# EAGLE schematic PDNode_Devboard_v0.0.1 (EAGLE 9.2.1), part 1 of 2

## Sheet 1 of 7
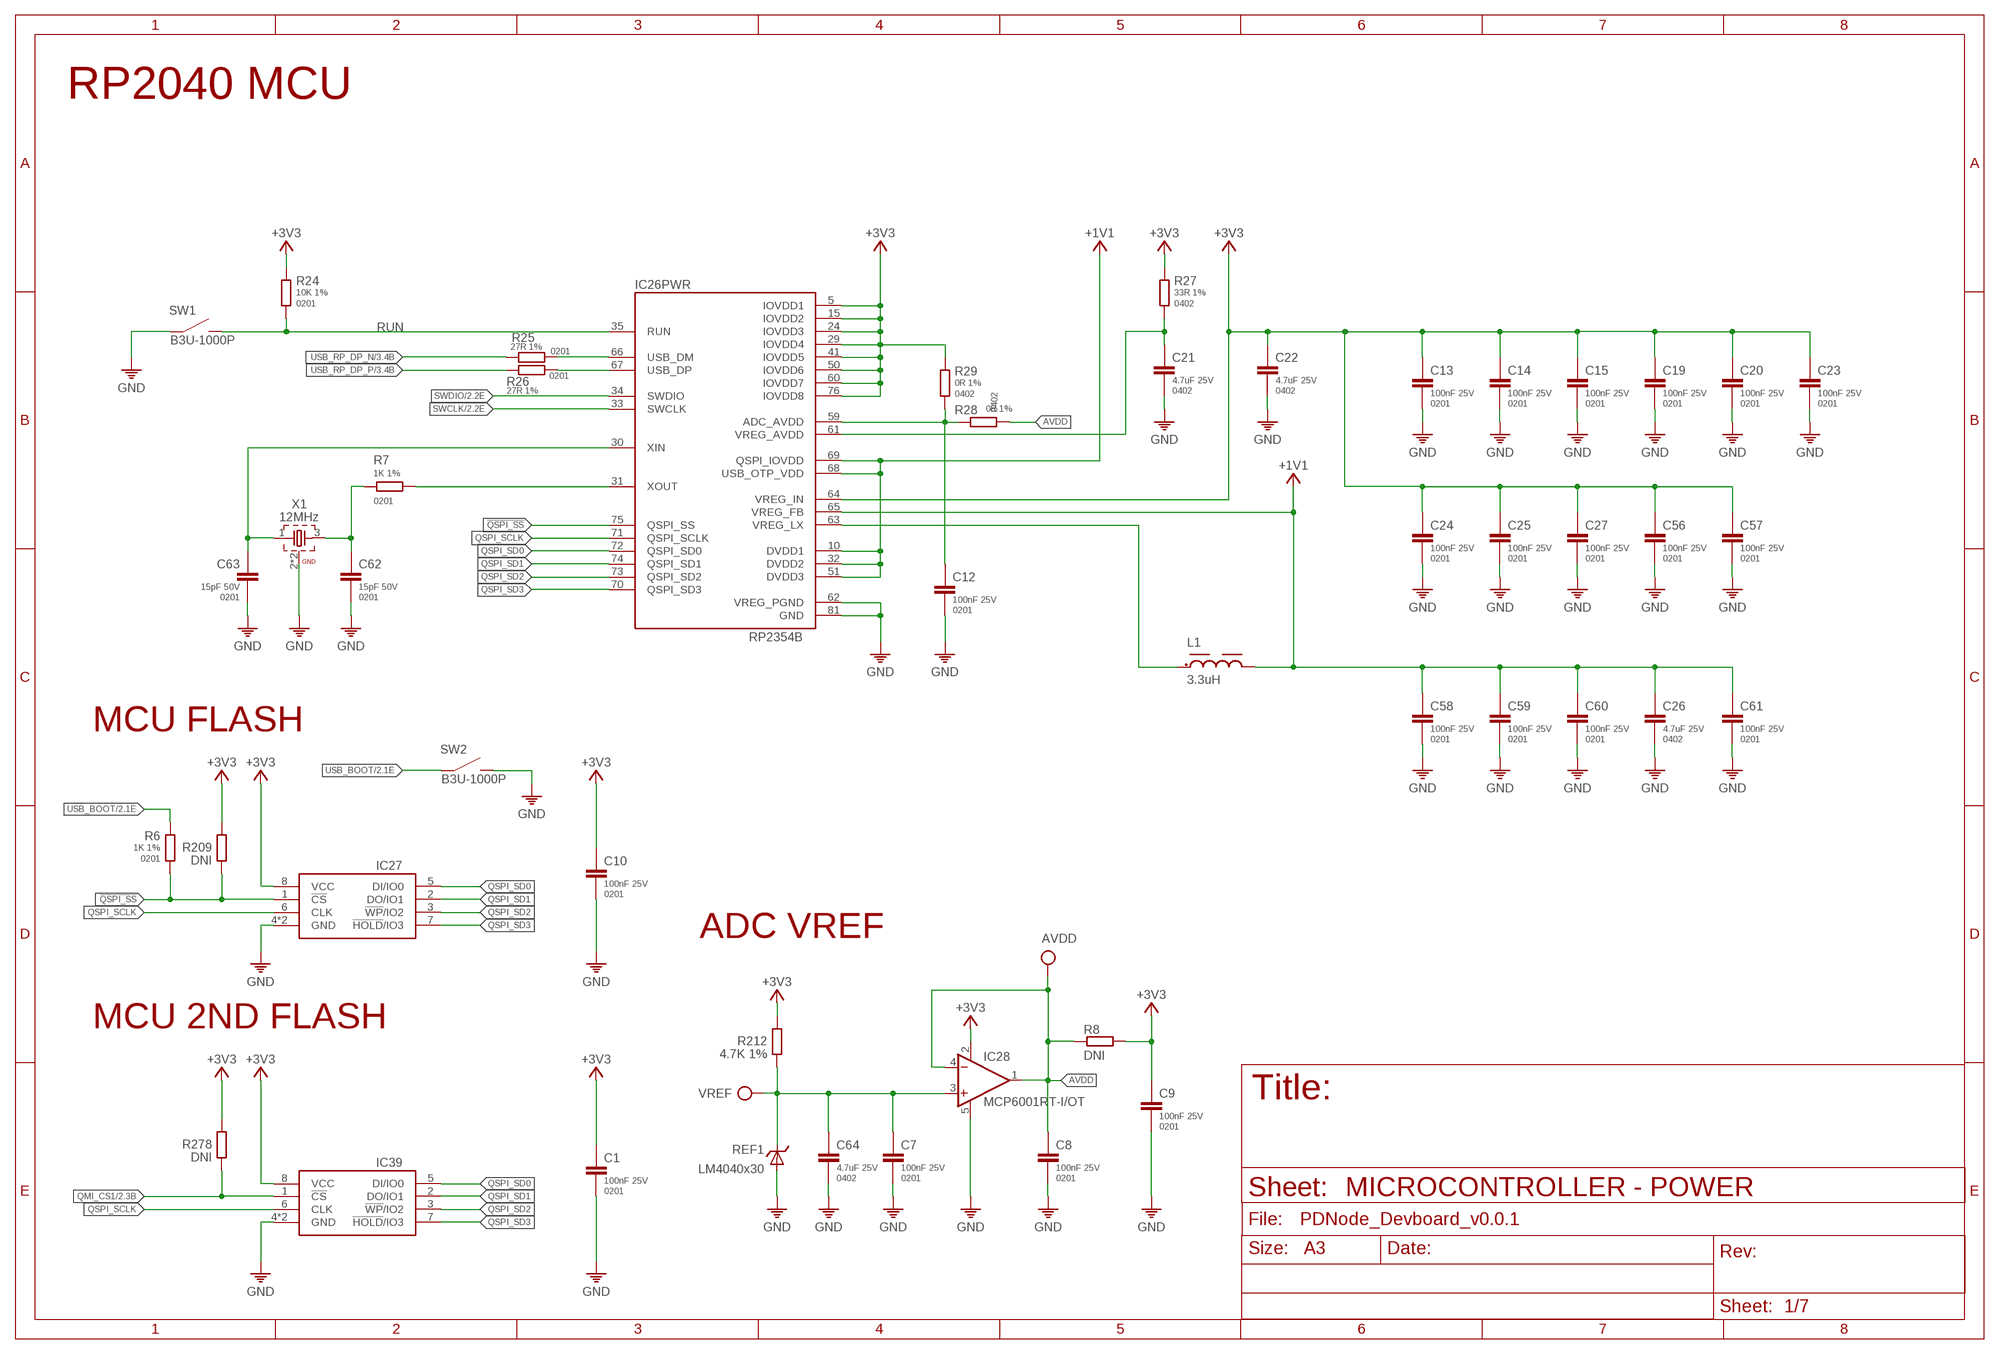
[diagram p0: schematic, sheet 1]

### Parts
AVDD  DNI  TP-ROUND  [TP-ROUND]
C1  100nF 25V  100NF-25V-0201  [0201]
C7  100nF 25V  100NF-25V-0201  [0201]
C8  100nF 25V  100NF-25V-0201  [0201]
C9  100nF 25V  100NF-25V-0201  [0201]
C10  100nF 25V  100NF-25V-0201  [0201]
C12  100nF 25V  100NF-25V-0201  [0201]
C13  100nF 25V  100NF-25V-0201  [0201]
C14  100nF 25V  100NF-25V-0201  [0201]
C15  100nF 25V  100NF-25V-0201  [0201]
C19  100nF 25V  100NF-25V-0201  [0201]
C20  100nF 25V  100NF-25V-0201  [0201]
C21  4.7uF 25V  4.7UF-25V0402  [0402]
C22  4.7uF 25V  4.7UF-25V0402  [0402]
C23  100nF 25V  100NF-25V-0201  [0201]
C24  100nF 25V  100NF-25V-0201  [0201]
C25  100nF 25V  100NF-25V-0201  [0201]
C26  4.7uF 25V  4.7UF-25V0402  [0402]
C27  100nF 25V  100NF-25V-0201  [0201]
C56  100nF 25V  100NF-25V-0201  [0201]
C57  100nF 25V  100NF-25V-0201  [0201]
C58  100nF 25V  100NF-25V-0201  [0201]
C59  100nF 25V  100NF-25V-0201  [0201]
C60  100nF 25V  100NF-25V-0201  [0201]
C61  100nF 25V  100NF-25V-0201  [0201]
C62  15pF 50V  15PF-50V0201  [0201]
C63  15pF 50V  15PF-50V0201  [0201]
C64  4.7uF 25V  4.7UF-25V0402  [0402]
IC26  RP2354B  RP235XB  [QFN80-10X10]
IC27  W25Q128JVPIQ  W25Q128JVP  [SON127P600X500X75-8N]
IC28  MCP6001RT-I/OT  MCP6001RT  [SOT23-5]
IC39  W25Q128JVPIQ  W25Q128JVP  [SON127P600X500X75-8N]
L1  3.3uH  3.3UH0805  [0805]
R6  1K 1%  1K-1%0201  [0201]
R7  1K 1%  1K-1%0201  [0201]
R8  DNI  R0201  [R0201]
R24  10K 1%  10K-1%0201  [0201]
R25  27R 1%  27R-1%0201  [0201]
R26  27R 1%  27R-1%0201  [0201]
R27  33R 1%  33R-1%0402  [0402]
R28  0R 1%  0R0402  [0402]
R29  0R 1%  0R0402  [0402]
R209  DNI  R0201  [R0201]
R212  4.7K 1%  4.7K-1%0201  [0201]
R278  DNI  R0201  [R0201]
REF1  LM4040x30  LM4040BXX  [SOT23]
SW1  B3U-1000P  B3U-1000P  [B3U-1000P]
SW2  B3U-1000P  B3U-1000P  [B3U-1000P]
VREF  DNI  TP-ROUND  [TP-ROUND]
X1  12MHz  CRYSTAL-3225X322512MSB4SI  [WE-XTAL_CFPX-180]

### Nets
!QSPI_SS: IC26.75(PWR:QSPI_SS) IC27.1(!CS) R6.2 R209.1
+1V1: C26.1 C58.1 C59.1 C60.1 C61.1 IC26.10(PWR:DVDD1) IC26.32(PWR:DVDD2) IC26.51(PWR:DVDD3) IC26.65(PWR:VREG_FB) IC26.68(PWR:USB_OTP_VDD) IC26.69(PWR:QSPI_IOVDD) L1.2
+3V3: C1.1 C9.1 C10.1 C13.1 C14.1 C15.1 C19.1 C20.1 C22.1 C23.1 C24.1 C25.1 C27.1 C56.1 C57.1 IC26.5(PWR:IOVDD1) IC26.15(PWR:IOVDD2) IC26.24(PWR:IOVDD3) IC26.29(PWR:IOVDD4) IC26.41(PWR:IOVDD5) IC26.50(PWR:IOVDD6) IC26.60(PWR:IOVDD7) IC26.64(PWR:VREG_IN) IC26.76(PWR:IOVDD8) IC27.8(VCC) IC28.2(V+) IC39.8(VCC) R8.2 R24.1 R27.1 R29.1 R209.2 R212.2 R278.2 ; also sheet 2,3,4,5,6,7
ADC_AVDD: C12.1 IC26.59(PWR:ADC_AVDD) R28.1 R29.2
AVDD: AVDD.TP C8.1 IC28.1(OUT) IC28.4(-IN) R8.1 R28.2
GND: C1.2 C7.2 C8.2 C9.2 C10.2 C12.2 C13.2 C14.2 C15.2 C19.2 C20.2 C21.2 C22.2 C23.2 C24.2 C25.2 C26.2 C27.2 C56.2 C57.2 C58.2 C59.2 C60.2 C61.2 C62.2 C63.2 C64.2 IC26.62(PWR:VREG_PGND) IC26.81(PWR:GND) IC27.4(GND) IC27.PAD(GND) IC28.5(V-) IC39.4(GND) IC39.PAD(GND) REF1.2(A) REF1.3(A) SW1.1 SW2.2 X1.2(GND) X1.4(GND) ; also sheet 2,3,4,5,6,7
N$21: C21.1 IC26.61(PWR:VREG_AVDD) R27.2
N$23: IC26.63(PWR:VREG_LX) L1.1
N$43: C62.1 R7.1 X1.3
QMI_CS1: IC39.1(!CS) R278.1 ; also sheet 2
QSPI_SCLK: IC26.71(PWR:QSPI_SCLK) IC27.6(CLK) IC39.6(CLK)
QSPI_SD0: IC26.72(PWR:QSPI_SD0) IC27.5(DI/IO0) IC39.5(DI/IO0)
QSPI_SD1: IC26.74(PWR:QSPI_SD1) IC27.2(DO/IO1) IC39.2(DO/IO1)
QSPI_SD2: IC26.73(PWR:QSPI_SD2) IC27.3(!WP!/IO2) IC39.3(!WP!/IO2)
QSPI_SD3: IC26.70(PWR:QSPI_SD3) IC27.7(!HOLD!/IO3) IC39.7(!HOLD!/IO3)
RP_XI: C63.1 IC26.30(PWR:XIN) X1.1
RP_XO: IC26.31(PWR:XOUT) R7.2
RUN: IC26.35(PWR:RUN) R24.2 SW1.2 ; also sheet 2
SWCLK: IC26.33(PWR:SWCLK) ; also sheet 2
SWDIO: IC26.34(PWR:SWDIO) ; also sheet 2
USB_BOOT: R6.1 SW2.1 ; also sheet 2
USB_RP_DP_N: R25.1 ; also sheet 3
USB_RP_DP_P: R26.1 ; also sheet 3
USB_RPR_DP_N [90R_DIFFPAIR]: IC26.66(PWR:USB_DM) R25.2
USB_RPR_DP_P [90R_DIFFPAIR]: IC26.67(PWR:USB_DP) R26.2
VREF: C7.1 C64.1 IC28.3(+IN) R212.1 REF1.1(C) VREF.TP

### Notes on the sheet
- RP2040 MCU
- MCU FLASH
- ADC VREF
- MCU 2ND FLASH
- MICROCONTROLLER - POWER

## Sheet 2 of 7
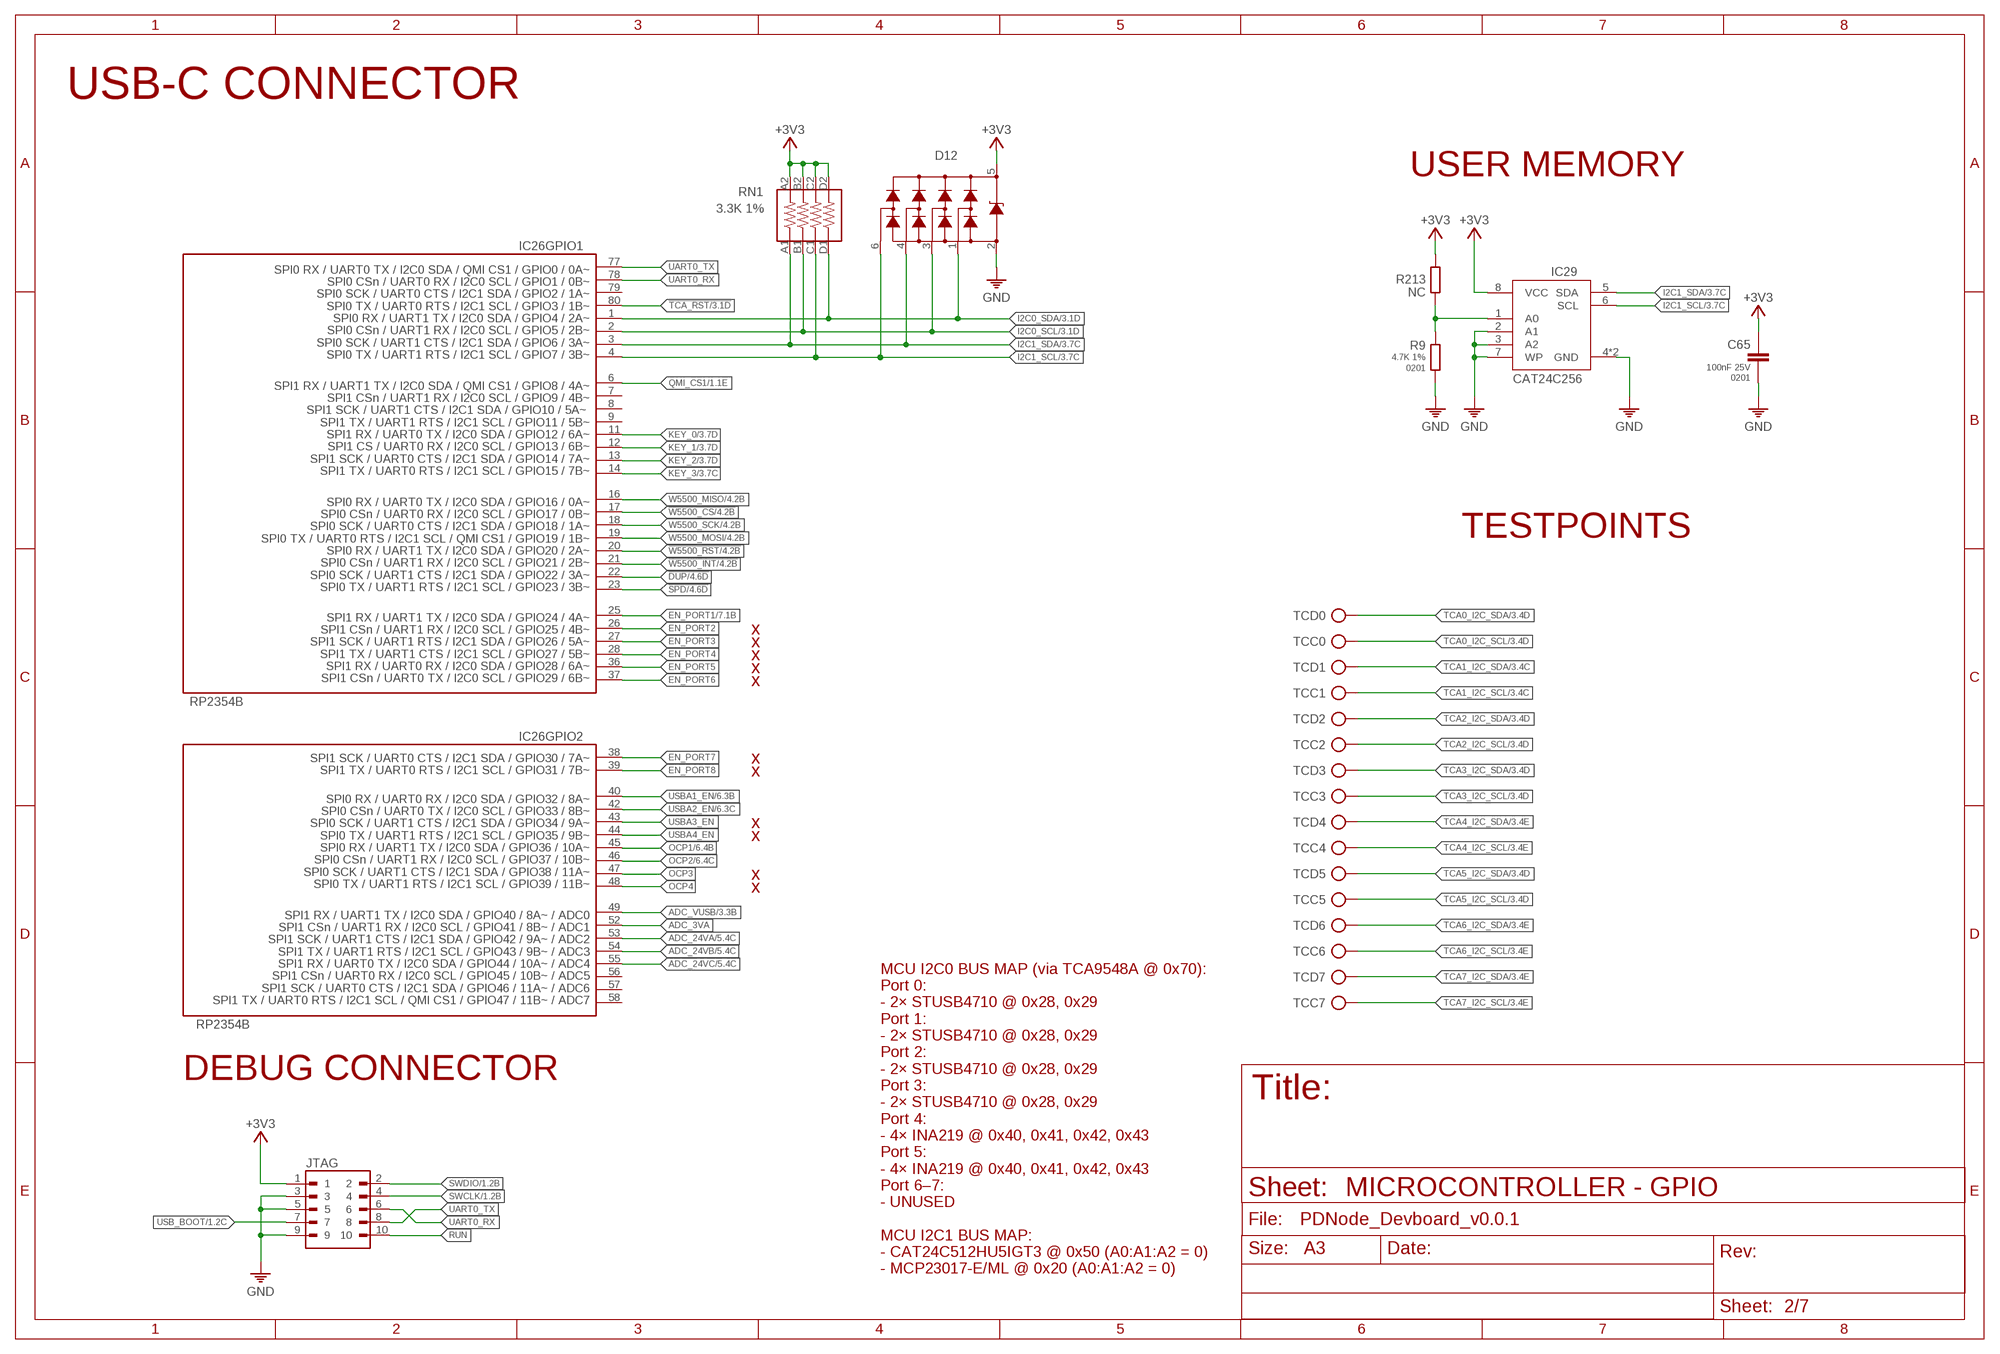
[diagram p1: schematic, sheet 2]

### Parts
C65  100nF 25V  100NF-25V-0201  [0201]
D12  HDMIULC6-4SC6Y  [SOT23-6]
IC29  CAT24C256HU4IGT3  CAT24C256-HU4  [SON50P300X200X50-9T130X140N]
JTAG  3220_10_0300_00  [3220_10_0300_00]
R9  4.7K 1%  4.7K-1%0201  [0201]
R213  NC  R0201  [R0201]
RN1  3.3K 1%  3.3K-1%_ARRAY0603X4-1206  [_0603X4-1206]
TCC0  DNI  TP-ROUND  [TP-ROUND]
TCC1  DNI  TP-ROUND  [TP-ROUND]
TCC2  DNI  TP-ROUND  [TP-ROUND]
TCC3  DNI  TP-ROUND  [TP-ROUND]
TCC4  DNI  TP-ROUND  [TP-ROUND]
TCC5  DNI  TP-ROUND  [TP-ROUND]
TCC6  DNI  TP-ROUND  [TP-ROUND]
TCC7  DNI  TP-ROUND  [TP-ROUND]
TCD0  DNI  TP-ROUND  [TP-ROUND]
TCD1  DNI  TP-ROUND  [TP-ROUND]
TCD2  DNI  TP-ROUND  [TP-ROUND]
TCD3  DNI  TP-ROUND  [TP-ROUND]
TCD4  DNI  TP-ROUND  [TP-ROUND]
TCD5  DNI  TP-ROUND  [TP-ROUND]
TCD6  DNI  TP-ROUND  [TP-ROUND]
TCD7  DNI  TP-ROUND  [TP-ROUND]

### Nets
!DUP: IC26.22(GPIO1:GPIO22) ; also sheet 4
!SPD: IC26.23(GPIO1:GPIO23) ; also sheet 4
!TCA_RST: IC26.80(GPIO1:GPIO3) ; also sheet 3
!W5500_CS: IC26.17(GPIO1:GPIO17) ; also sheet 4
!W5500_INT: IC26.21(GPIO1:GPIO21) ; also sheet 4
!W5500_RST: IC26.20(GPIO1:GPIO20) ; also sheet 4
+3V3: C65.1 D12.5 IC29.8(VCC) JTAG.1 R213.2 RN1.A2 RN1.B2 RN1.C2 RN1.D2 ; also sheet 1,3,4,5,6,7
ADC_3VA: IC26.52(GPIO2:GPIO41_ADC1)
ADC_24VA: IC26.53(GPIO2:GPIO42_ADC2) ; also sheet 5
ADC_24VB: IC26.54(GPIO2:GPIO43_ADC3) ; also sheet 5
ADC_24VC: IC26.55(GPIO2:GPIO44_ADC4) ; also sheet 5
ADC_VUSB: IC26.49(GPIO2:GPIO40_ADC0) ; also sheet 3
EN_PORT1: IC26.25(GPIO1:GPIO24) ; also sheet 7
EN_PORT2: IC26.26(GPIO1:GPIO25)
EN_PORT3: IC26.27(GPIO1:GPIO26)
EN_PORT4: IC26.28(GPIO1:GPIO27)
EN_PORT5: IC26.36(GPIO1:GPIO28)
EN_PORT6: IC26.37(GPIO1:GPIO29)
EN_PORT7: IC26.38(GPIO2:GPIO30)
EN_PORT8: IC26.39(GPIO2:GPIO31)
GND: C65.2 D12.2 IC29.2(A1) IC29.3(A2) IC29.4(GND) IC29.7(WP) IC29.9(GND) JTAG.3 JTAG.5 JTAG.9 R9.2 ; also sheet 1,3,4,5,6,7
I2C0_SCL: D12.3 IC26.2(GPIO1:GPIO5) RN1.B1 ; also sheet 3
I2C0_SDA: D12.1 IC26.1(GPIO1:GPIO4) RN1.D1 ; also sheet 3
I2C1_SCL: D12.6 IC26.4(GPIO1:GPIO7) IC29.6(SCL) RN1.C1 ; also sheet 3
I2C1_SDA: D12.4 IC26.3(GPIO1:GPIO6) IC29.5(SDA) RN1.A1 ; also sheet 3
KEY_0: IC26.11(GPIO1:GPIO12) ; also sheet 3
KEY_1: IC26.12(GPIO1:GPIO13) ; also sheet 3
KEY_2: IC26.13(GPIO1:GPIO14) ; also sheet 3
KEY_3: IC26.14(GPIO1:GPIO15) ; also sheet 3
N$222: IC29.1(A0) R9.1 R213.1
OCP1: IC26.45(GPIO2:GPIO36) ; also sheet 6
OCP2: IC26.46(GPIO2:GPIO37) ; also sheet 6
OCP3: IC26.47(GPIO2:GPIO38)
OCP4: IC26.48(GPIO2:GPIO39)
QMI_CS1: IC26.6(GPIO1:GPIO8) ; also sheet 1
RUN: JTAG.10 ; also sheet 1
SWCLK: JTAG.4 ; also sheet 1
SWDIO: JTAG.2 ; also sheet 1
TCA0_I2C_SCL: TCC0.TP ; also sheet 3,7
TCA0_I2C_SDA: TCD0.TP ; also sheet 3,7
TCA1_I2C_SCL: TCC1.TP ; also sheet 3
TCA1_I2C_SDA: TCD1.TP ; also sheet 3
TCA2_I2C_SCL: TCC2.TP ; also sheet 3
TCA2_I2C_SDA: TCD2.TP ; also sheet 3
TCA3_I2C_SCL: TCC3.TP ; also sheet 3
TCA3_I2C_SDA: TCD3.TP ; also sheet 3
TCA4_I2C_SCL: TCC4.TP ; also sheet 3,7
TCA4_I2C_SDA: TCD4.TP ; also sheet 3,7
TCA5_I2C_SCL: TCC5.TP ; also sheet 3
TCA5_I2C_SDA: TCD5.TP ; also sheet 3
TCA6_I2C_SCL: TCC6.TP ; also sheet 3
TCA6_I2C_SDA: TCD6.TP ; also sheet 3
TCA7_I2C_SCL: TCC7.TP ; also sheet 3
TCA7_I2C_SDA: TCD7.TP ; also sheet 3
UART0_RX: IC26.78(GPIO1:GPIO1) JTAG.6
UART0_TX: IC26.77(GPIO1:GPIO0) JTAG.8
USB_BOOT: JTAG.7 ; also sheet 1
USBA1_EN: IC26.40(GPIO2:GPIO32) ; also sheet 6
USBA2_EN: IC26.42(GPIO2:GPIO33) ; also sheet 6
USBA3_EN: IC26.43(GPIO2:GPIO34)
USBA4_EN: IC26.44(GPIO2:GPIO35)
W5500_MISO: IC26.16(GPIO1:GPIO16) ; also sheet 4
W5500_MOSI: IC26.19(GPIO1:GPIO19) ; also sheet 4
W5500_SCK: IC26.18(GPIO1:GPIO18) ; also sheet 4
Unconnected: IC26.7(GPIO1:GPIO9) IC26.8(GPIO1:GPIO10) IC26.9(GPIO1:GPIO11) IC26.56(GPIO2:GPIO45_ADC5) IC26.57(GPIO2:GPIO46_ADC6) IC26.58(GPIO2:GPIO47_ADC7) IC26.79(GPIO1:GPIO2)

### Notes on the sheet
- USB-C CONNECTOR
- USER MEMORY
- TESTPOINTS
- x
- x
- x
- x
- x
- x
- x
- x
- x
- x
- x
- DEBUG CONNECTOR
- MICROCONTROLLER - GPIO
- MCU I2C0 BUS MAP (via TCA9548A @ 0x70):
  Port 0:
  - 2× STUSB4710 @ 0x28, 0x29
  Port 1:
  - 2× STUSB4710 @ 0x28, 0x29
  Port 2:
  - 2× STUSB4710 @ 0x28, 0x29
  Port 3:
  - 2× STUSB4710 @ 0x28, 0x29
  Port 4:
  - 4× INA219 @ 0x40, 0x41, 0x42, 0x43
  Port 5:
  - 4× INA219 @ 0x40, 0x41, 0x42, 0x43
  Port 6–7:
  - UNUSED
  
  MCU I2C1 BUS MAP:
  - CAT24C512HU5IGT3 @ 0x50 (A0:A1:A2 = 0)
  - MCP23017-E/ML @ 0x20 (A0:A1:A2 = 0)

## Sheet 3 of 7
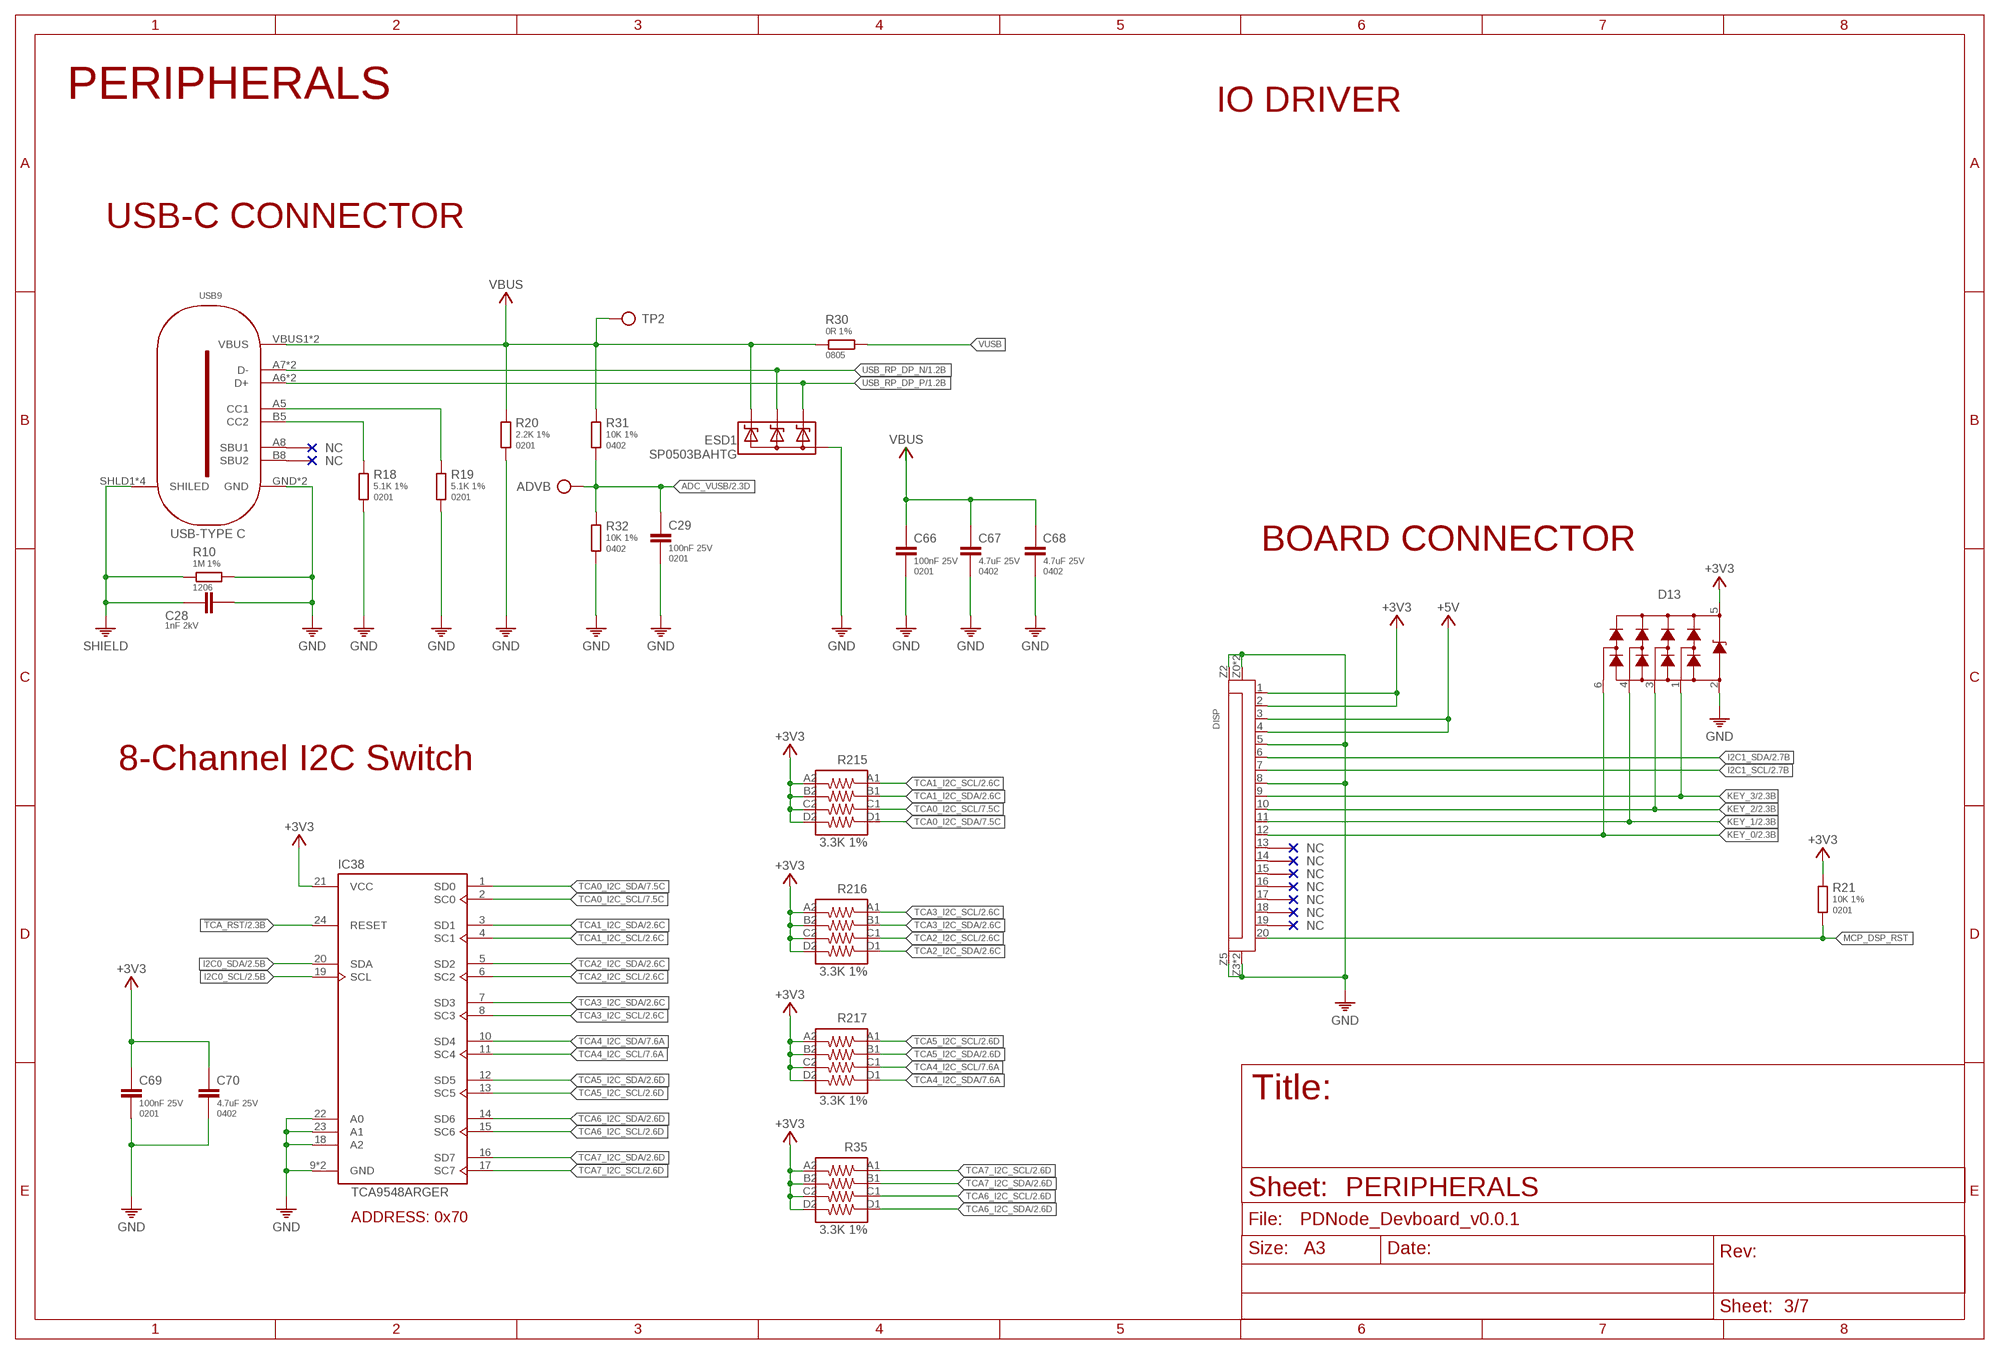
[diagram p2: schematic, sheet 3]

### Parts
ADVB  DNI  TP-ROUND  [TP-ROUND]
C28  1nF 2kV  1NF-2KV  [1206]
C29  100nF 25V  100NF-25V-0201  [0201]
C66  100nF 25V  100NF-25V-0201  [0201]
C67  4.7uF 25V  4.7UF-25V0402  [0402]
C68  4.7uF 25V  4.7UF-25V0402  [0402]
C69  100nF 25V  100NF-25V-0201  [0201]
C70  4.7uF 25V  4.7UF-25V0402  [0402]
D13  HDMIULC6-4SC6Y  [SOT23-6]
DISP  AFC11-S20ICC-00  AFC11-S20ICC-00  [FPC20]
ESD1  SP0503BAHTG  SP0503BAHT  [SOT143]
IC38  TCA9548ARGER  [QFN50P400X400X100-25T210N]
R10  1M 1%  1M-1%1206  [1206]
R18  5.1K 1%  5.1K-1%0201  [0201]
R19  5.1K 1%  5.1K-1%0201  [0201]
R20  2.2K 1%  2.2K-1%0201  [0201]
R21  10K 1%  10K-1%0201  [0201]
R30  0R 1%  0R0805  [0805]
R31  10K 1%  10K-1%0402  [0402]
R32  10K 1%  10K-1%0402  [0402]
R35  3.3K 1%  3.3K-1%_ARRAY0603X4-1206  [_0603X4-1206]
R215  3.3K 1%  3.3K-1%_ARRAY0603X4-1206  [_0603X4-1206]
R216  3.3K 1%  3.3K-1%_ARRAY0603X4-1206  [_0603X4-1206]
R217  3.3K 1%  3.3K-1%_ARRAY0603X4-1206  [_0603X4-1206]
TP2  DNI  TP-ROUND  [TP-ROUND]
USB9  USB-TYPE-C-018  USB_C-THT  [USB-C]

### Nets
!TCA_RST: IC38.24(RESET) ; also sheet 2
+3V3: C69.1 C70.1 D13.5 DISP.1 DISP.2 IC38.21(VCC) R21.1 R35.A2 R35.B2 R35.C2 R35.D2 R215.A2 R215.B2 R215.C2 R215.D2 R216.A2 R216.B2 R216.C2 R216.D2 R217.A2 R217.B2 R217.C2 R217.D2 ; also sheet 1,2,4,5,6,7
+5V: DISP.3 DISP.4
ADC_VUSB: ADVB.TP C29.1 R31.2 R32.1 ; also sheet 2
CC1: R19.1 USB9.A5(CC1)
CC2: R18.1 USB9.B5(CC2)
GND: C28.2 C29.2 C66.2 C67.2 C68.2 C69.2 C70.2 D13.2 DISP.5 DISP.8 DISP.Z0(Z1) DISP.Z1 DISP.Z2 DISP.Z3 DISP.Z4(Z3) DISP.Z5(Z4) ESD1.1(A) IC38.9(GND) IC38.18(A2) IC38.22(A0) IC38.23(A1) IC38.25(GND) R10.2 R18.2 R19.2 R20.2 R32.2 USB9.GND USB9.GND2(GND) ; also sheet 1,2,4,5,6,7
I2C0_SCL: IC38.19(SCL) ; also sheet 2
I2C0_SDA: IC38.20(SDA) ; also sheet 2
I2C1_SCL: DISP.7 ; also sheet 2
I2C1_SDA: DISP.6 ; also sheet 2
KEY_0: D13.6 DISP.12 ; also sheet 2
KEY_1: D13.4 DISP.11 ; also sheet 2
KEY_2: D13.3 DISP.10 ; also sheet 2
KEY_3: D13.1 DISP.9 ; also sheet 2
MCP_DSP_RST: DISP.20 R21.2
SHIELD: C28.1 R10.1 USB9.SHLD1(SHILED) USB9.SHLD2(SHILED) USB9.SHLD3(SHILED) USB9.SHLD4(SHILED) ; also sheet 4,6,7
TCA0_I2C_SCL: IC38.2(SC0) R215.C1 ; also sheet 2,7
TCA0_I2C_SDA: IC38.1(SD0) R215.D1 ; also sheet 2,7
TCA1_I2C_SCL: IC38.4(SC1) R215.A1 ; also sheet 2
TCA1_I2C_SDA: IC38.3(SD1) R215.B1 ; also sheet 2
TCA2_I2C_SCL: IC38.6(SC2) R216.C1 ; also sheet 2
TCA2_I2C_SDA: IC38.5(SD2) R216.D1 ; also sheet 2
TCA3_I2C_SCL: IC38.8(SC3) R216.A1 ; also sheet 2
TCA3_I2C_SDA: IC38.7(SD3) R216.B1 ; also sheet 2
TCA4_I2C_SCL: IC38.11(SC4) R217.C1 ; also sheet 2,7
TCA4_I2C_SDA: IC38.10(SD4) R217.D1 ; also sheet 2,7
TCA5_I2C_SCL: IC38.13(SC5) R217.A1 ; also sheet 2
TCA5_I2C_SDA: IC38.12(SD5) R217.B1 ; also sheet 2
TCA6_I2C_SCL: IC38.15(SC6) R35.C1 ; also sheet 2
TCA6_I2C_SDA: IC38.14(SD6) R35.D1 ; also sheet 2
TCA7_I2C_SCL: IC38.17(SC7) R35.A1 ; also sheet 2
TCA7_I2C_SDA: IC38.16(SD7) R35.B1 ; also sheet 2
USB_RP_DP_N: ESD1.3(C2) USB9.A7(D-) USB9.B7(D-) ; also sheet 1
USB_RP_DP_P: ESD1.2(C1) USB9.A6(D+) USB9.B6(D+) ; also sheet 1
VBUS: C66.1 C67.1 C68.1 ESD1.4(C3) R20.1 R30.1 R31.1 TP2.TP USB9.VBUS1(VBUS) USB9.VBUS2(VBUS)
VUSB: R30.2
Unconnected: DISP.13 DISP.14 DISP.15 DISP.16 DISP.17 DISP.18 DISP.19 USB9.A8(SBU1) USB9.B8(SBU2)

### Notes on the sheet
- PERIPHERALS
- IO DRIVER
- USB-C CONNECTOR
- BOARD CONNECTOR
- 8-Channel I2C Switch
- PERIPHERALS
- ADDRESS: 0x70

## Sheet 4 of 7
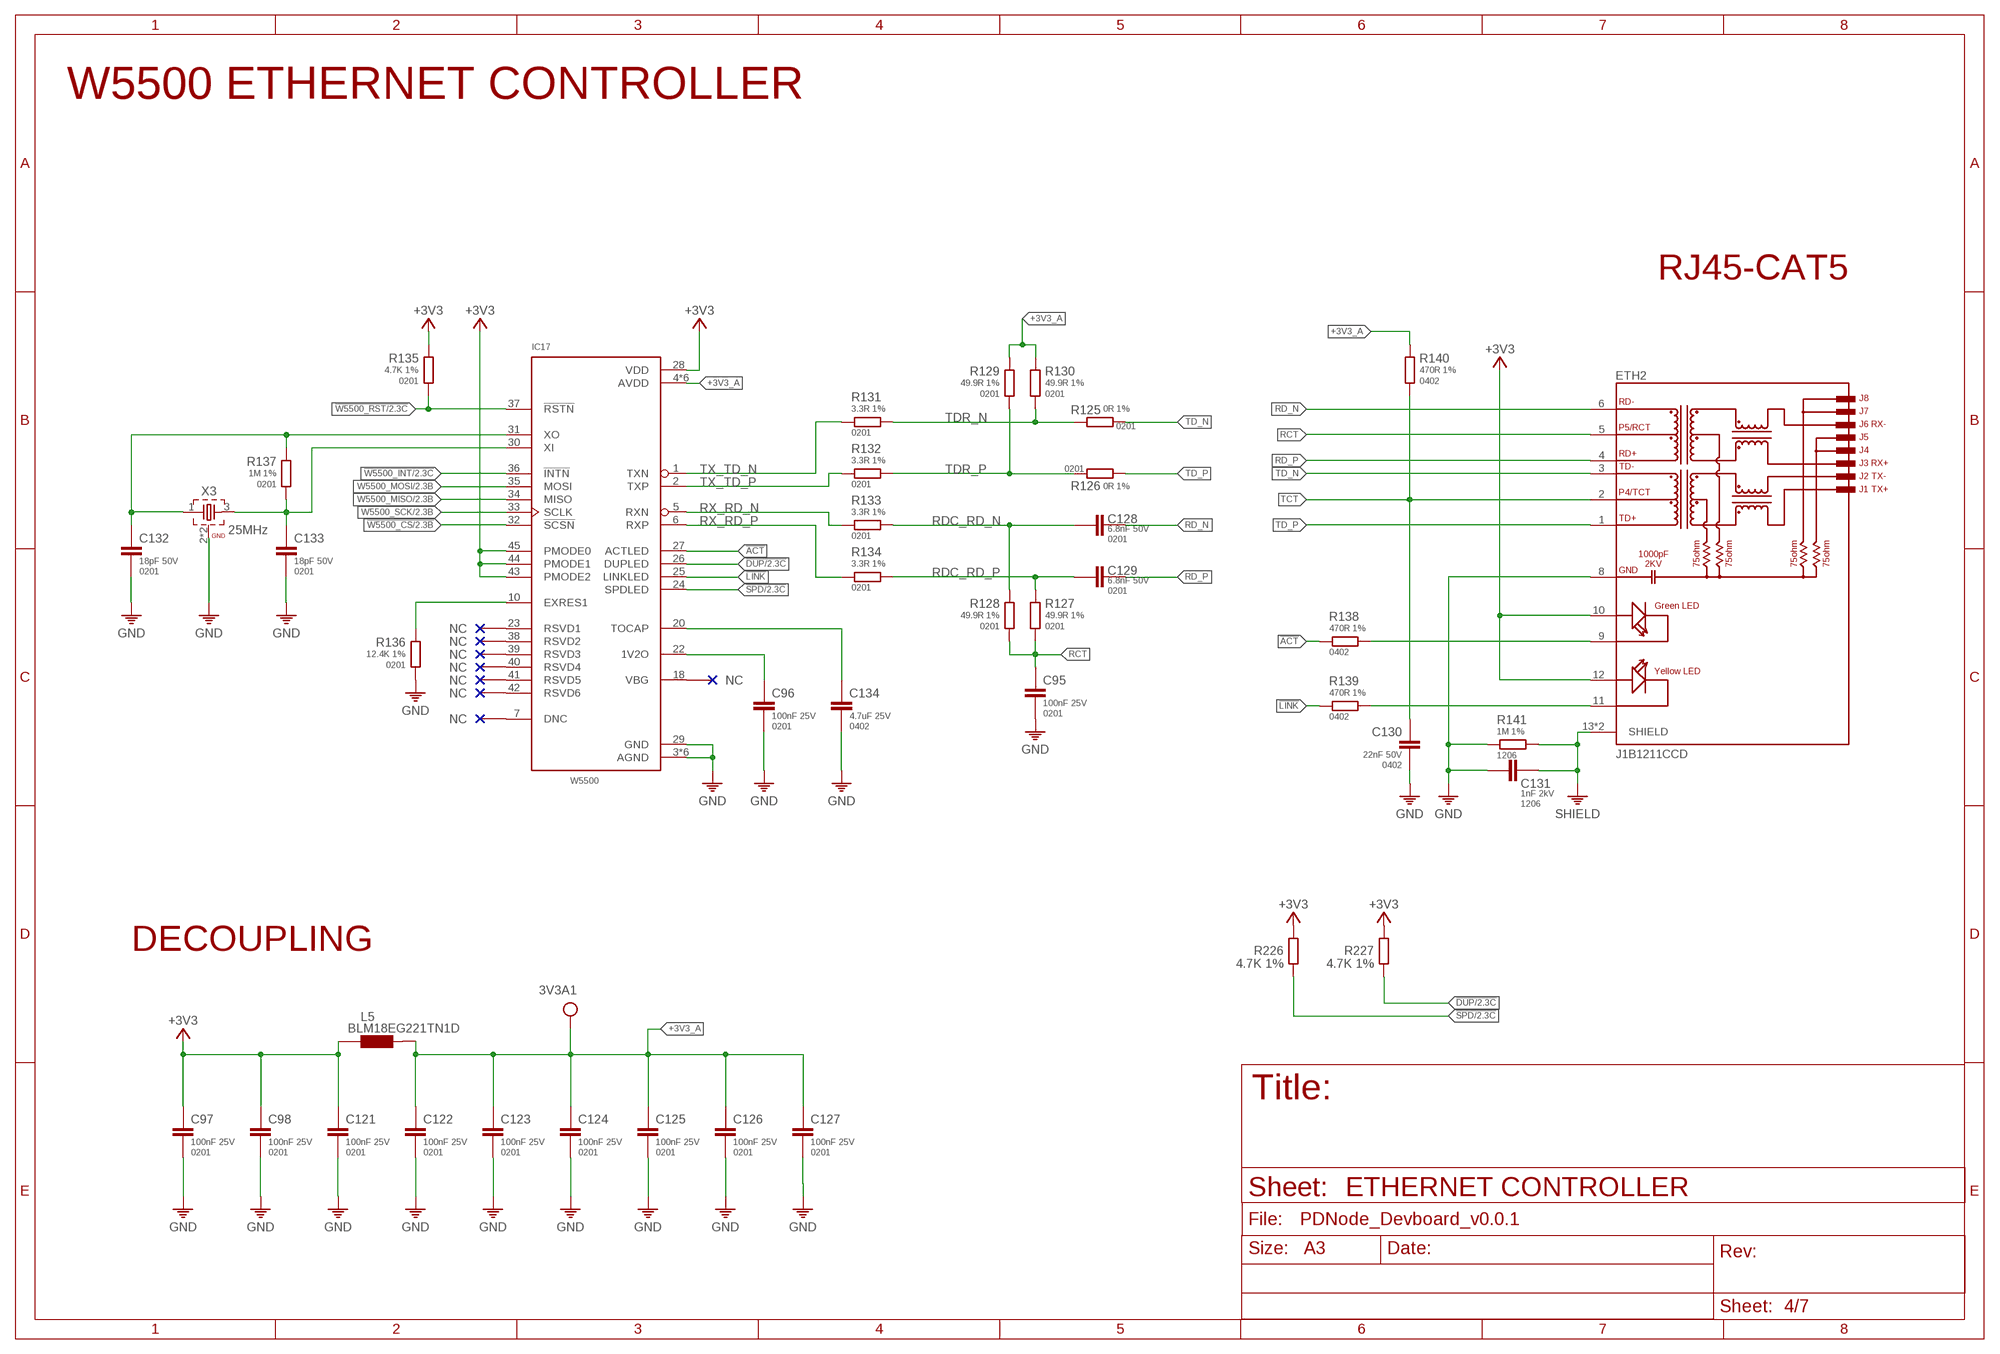
[diagram p3: schematic, sheet 4]

### Parts
3V3A1  DNI  TP-ROUND  [TP-ROUND]
C95  100nF 25V  100NF-25V-0201  [0201]
C96  100nF 25V  100NF-25V-0201  [0201]
C97  100nF 25V  100NF-25V-0201  [0201]
C98  100nF 25V  100NF-25V-0201  [0201]
C121  100nF 25V  100NF-25V-0201  [0201]
C122  100nF 25V  100NF-25V-0201  [0201]
C123  100nF 25V  100NF-25V-0201  [0201]
C124  100nF 25V  100NF-25V-0201  [0201]
C125  100nF 25V  100NF-25V-0201  [0201]
C126  100nF 25V  100NF-25V-0201  [0201]
C127  100nF 25V  100NF-25V-0201  [0201]
C128  6.8nF 50V  6.8NF-50V0201  [0201]
C129  6.8nF 50V  6.8NF-50V0201  [0201]
C130  22nF 50V  22NF-50V0402  [0402]
C131  1nF 2kV  1NF-2KV  [1206]
C132  18pF 50V  18PF-50V-0201  [0201]
C133  18pF 50V  18PF-50V-0201  [0201]
C134  4.7uF 25V  4.7UF-25V0402  [0402]
ETH2  J1B1211CCD  [J1B1211CCD]
IC17  W5500  [LQFP48]
L5  BLM18EG221TN1D  [0603]
R125  0R 1%  0R0201  [0201]
R126  0R 1%  0R0201  [0201]
R127  49.9R 1%  49.9R-1%0201  [0201]
R128  49.9R 1%  49.9R-1%0201  [0201]
R129  49.9R 1%  49.9R-1%0201  [0201]
R130  49.9R 1%  49.9R-1%0201  [0201]
R131  3.3R 1%  3.3R-1%0201  [0201]
R132  3.3R 1%  3.3R-1%0201  [0201]
R133  3.3R 1%  3.3R-1%0201  [0201]
R134  3.3R 1%  3.3R-1%0201  [0201]
R135  4.7K 1%  4.7K-1%0201  [0201]
R136  12.4K 1%  12.4K-1%0201  [0201]
R137  1M 1%  1M-1%0201  [0201]
R138  470R 1%  470R-1%0402  [0402]
R139  470R 1%  470R-1%0402  [0402]
R140  470R 1%  470R-1%0402  [0402]
R141  1M 1%  1M-1%1206  [1206]
R226  4.7K 1%  4.7K-1%0201  [0201]
R227  4.7K 1%  4.7K-1%0201  [0201]
X3  25MHz  CRYSTAL-3225X322525MOB4SI  [WE-XTAL_CFPX-180]

### Nets
!ACT: IC17.27(ACTLED) R138.1
!DUP: IC17.26(DUPLED) R227.1 ; also sheet 2
!LINK: IC17.25(LINKLED) R139.1
!SPD: IC17.24(SPDLED) R226.1 ; also sheet 2
!W5500_CS: IC17.32(!SCSN) ; also sheet 2
!W5500_INT: IC17.36(!INTN) ; also sheet 2
!W5500_RST: IC17.37(!RSTN) R135.2 ; also sheet 2
+3V3: C97.1 C98.1 C121.1 ETH2.10(GREEN+) ETH2.12(YELLOW+) IC17.28(VDD) IC17.43(PMODE2) IC17.44(PMODE1) IC17.45(PMODE0) L5.1 R135.1 R226.2 R227.2 ; also sheet 1,2,3,5,6,7
+3V3_A: 3V3A1.TP C122.1 C123.1 C124.1 C125.1 C126.1 C127.1 IC17.4(AVDD) IC17.8(AVDD) IC17.11(AVDD) IC17.15(AVDD) IC17.17(AVDD) IC17.21(AVDD) L5.2 R129.1 R130.1 R140.1
GND: C95.2 C96.2 C97.2 C98.2 C121.2 C122.2 C123.2 C124.2 C125.2 C126.2 C127.2 C130.2 C131.2 C132.2 C133.2 C134.2 ETH2.8(GND) IC17.3(AGND) IC17.9(AGND) IC17.14(AGND) IC17.16(AGND) IC17.19(AGND) IC17.29(GND) IC17.48(AGND) R136.2 R141.1 X3.2(GND) X3.4(GND) ; also sheet 1,2,3,5,6,7
N$83: ETH2.11(YELLOW-) R139.2
N$86: ETH2.9(GREEN-) R138.2
N$87: IC17.10(EXRES1) R136.1
N$88: C96.1 IC17.22(1V2O)
N$89: C134.1 IC17.20(TOCAP)
N$90: C133.1 IC17.30(XI) R137.2 X3.3
RCT: C95.1 ETH2.5(P5/RCT) R127.2 R128.2
RD_N [100R_DIFFPAIR]: C128.2 ETH2.6(RD-)
RD_P [100R_DIFFPAIR]: C129.2 ETH2.4(RD+)
RDC_RD_N [100R_DIFFPAIR]: C128.1 R128.1 R133.2
RDC_RD_P [100R_DIFFPAIR]: C129.1 R127.1 R134.2
RX_RD_N [100R_DIFFPAIR]: IC17.5(RXN) R133.1
RX_RD_P [100R_DIFFPAIR]: IC17.6(RXP) R134.1
SHIELD: C131.1 ETH2.13(SHIELD) ETH2.14(SHIELD) R141.2 ; also sheet 3,6,7
TCT: C130.1 ETH2.2(P4/TCT) R140.2
TD_N [100R_DIFFPAIR]: ETH2.3(TD-) R125.2
TD_P [100R_DIFFPAIR]: ETH2.1(TD+) R126.2
TDR_N [100R_DIFFPAIR]: R125.1 R130.2 R131.2
TDR_P [100R_DIFFPAIR]: R126.1 R129.2 R132.2
TX_TD_N [100R_DIFFPAIR]: IC17.1(TXN) R131.1
TX_TD_P [100R_DIFFPAIR]: IC17.2(TXP) R132.1
W5500_MISO: IC17.34(MISO) ; also sheet 2
W5500_MOSI: IC17.35(MOSI) ; also sheet 2
W5500_SCK: IC17.33(SCLK) ; also sheet 2
XO1: C132.1 IC17.31(XO) R137.1 X3.1
Unconnected: IC17.7(DNC) IC17.18(VBG) IC17.23(RSVD1) IC17.38(RSVD2) IC17.39(RSVD3) IC17.40(RSVD4) IC17.41(RSVD5) IC17.42(RSVD6)

### Notes on the sheet
- W5500 ETHERNET CONTROLLER
- RJ45-CAT5
- DECOUPLING
- ETHERNET CONTROLLER

## Sheet 5 of 7
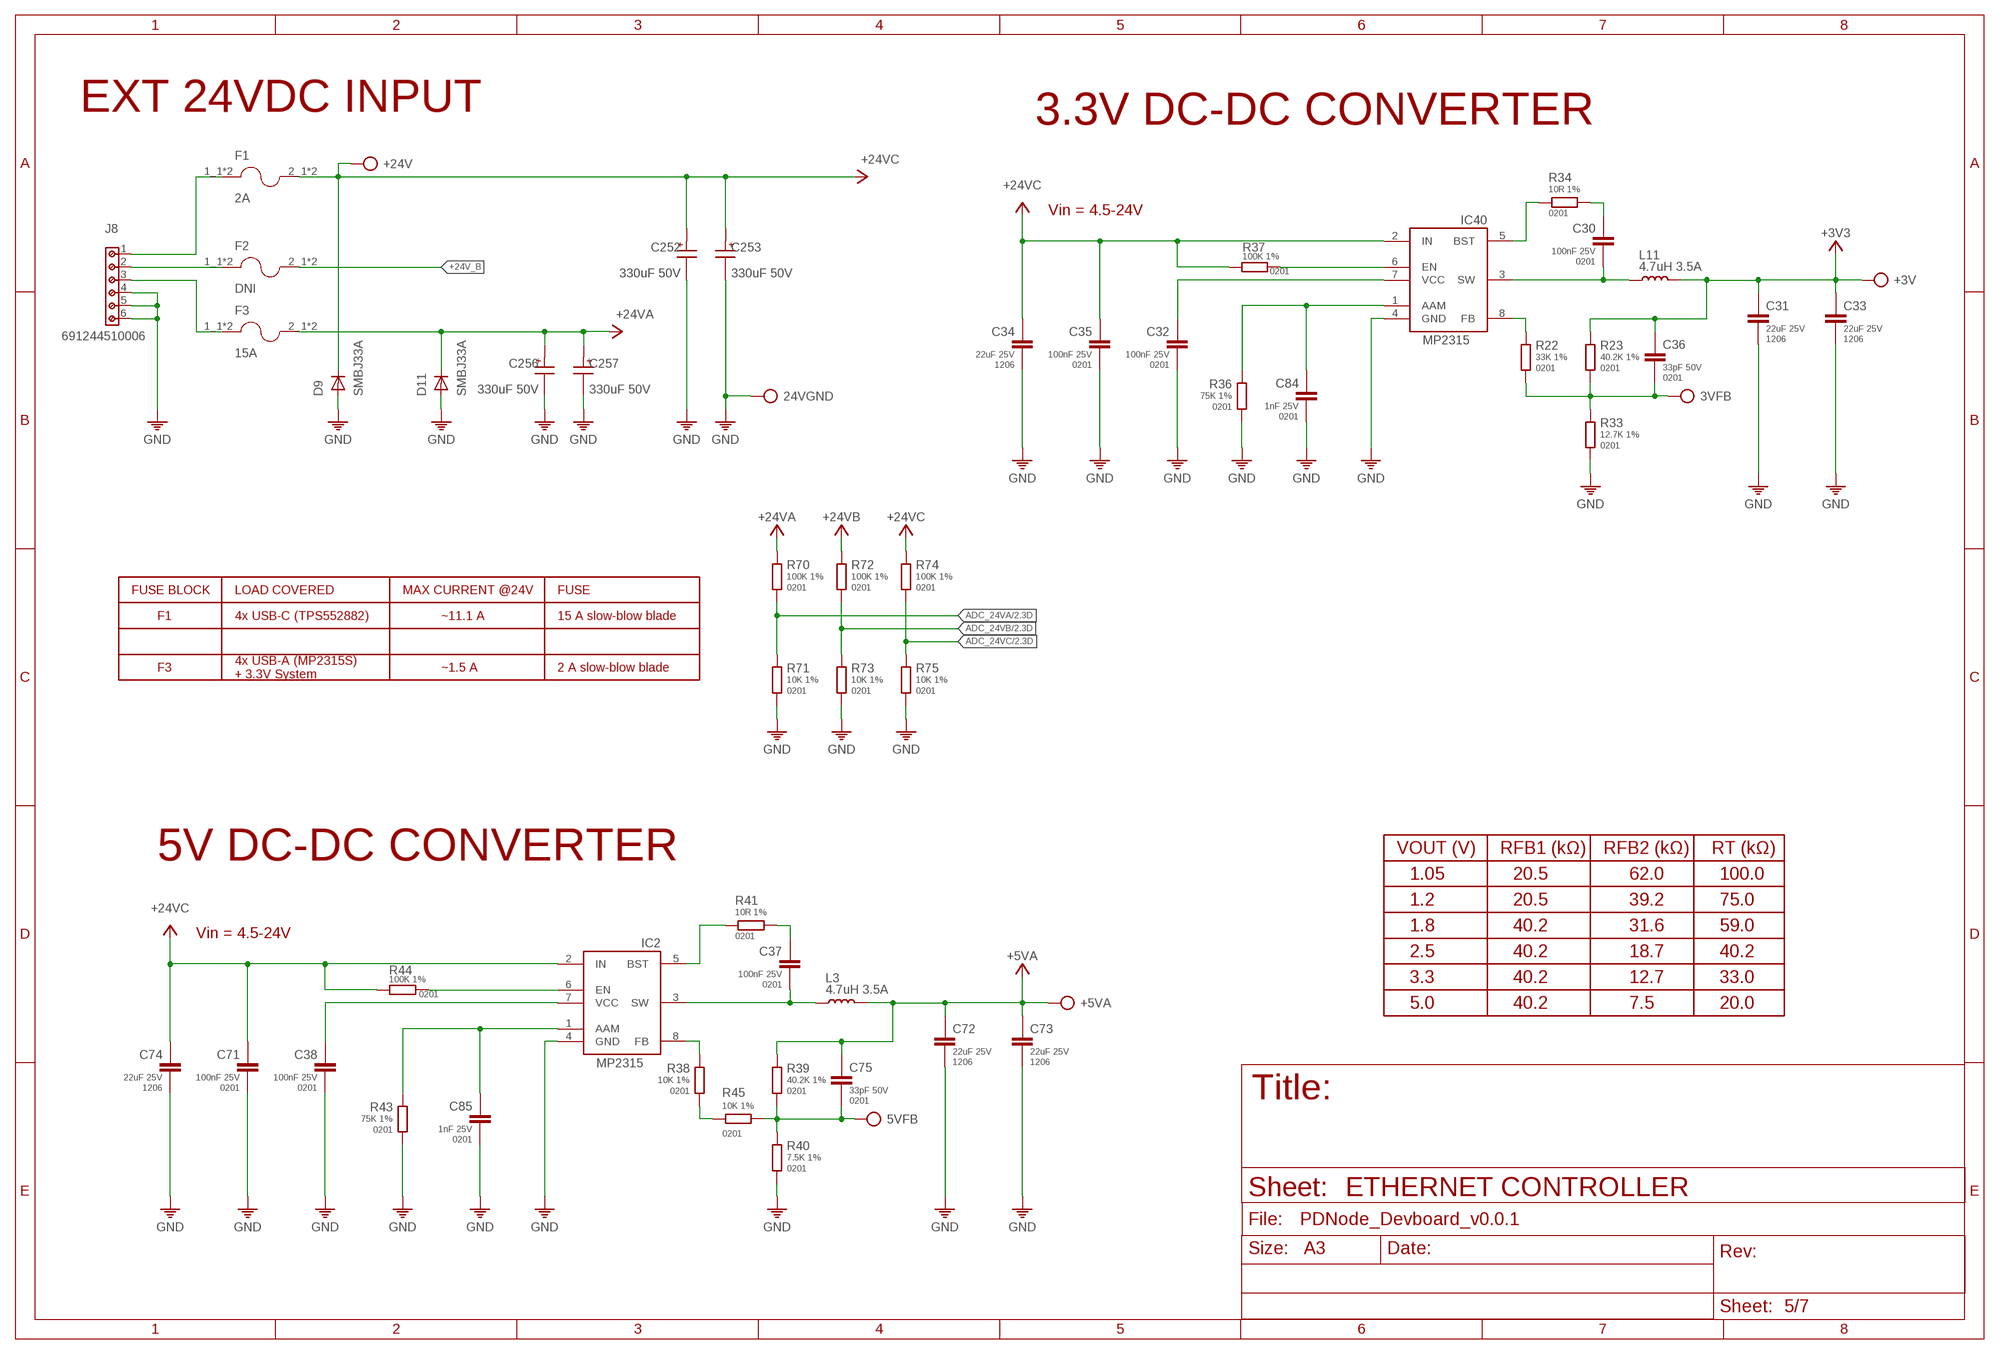
[diagram p4: schematic, sheet 5]

### Parts
3VFB  DNI  TP-ROUND  [TP-ROUND]
5VFB  DNI  TP-ROUND  [TP-ROUND]
24VGND  DNI  TP-ROUND  [TP-ROUND]
+3V  DNI  TP-ROUND  [TP-ROUND]
+5VA  DNI  TP-ROUND  [TP-ROUND]
+24V  DNI  TP-ROUND  [TP-ROUND]
C30  100nF 25V  100NF-25V-0201  [0201]
C31  22uF 25V  22UF-25V-1206  [1206]
C32  100nF 25V  100NF-25V-0201  [0201]
C33  22uF 25V  22UF-25V-1206  [1206]
C34  22uF 25V  22UF-25V-1206  [1206]
C35  100nF 25V  100NF-25V-0201  [0201]
C36  33pF 50V  33PF-50V0201  [0201]
C37  100nF 25V  100NF-25V-0201  [0201]
C38  100nF 25V  100NF-25V-0201  [0201]
C71  100nF 25V  100NF-25V-0201  [0201]
C72  22uF 25V  22UF-25V-1206  [1206]
C73  22uF 25V  22UF-25V-1206  [1206]
C74  22uF 25V  22UF-25V-1206  [1206]
C75  33pF 50V  33PF-50V0201  [0201]
C84  1nF 25V  1NF-25V-0201  [0201]
C85  1nF 25V  1NF-25V-0201  [0201]
C252  330uF 50V  330UF-50V10X10.5(DXL)  [10X10.5(DXL)]
C253  330uF 50V  330UF-50V10X10.5(DXL)  [10X10.5(DXL)]
C256  330uF 50V  330UF-50V10X10.5(DXL)  [10X10.5(DXL)]
C257  330uF 50V  330UF-50V10X10.5(DXL)  [10X10.5(DXL)]
D9  SMBJ33A  DIODE-SMB  [SMB]
D11  SMBJ33A  DIODE-SMB  [SMB]
F1  2A  BLADE-FUSE  [FUSE_3544-2]
F2  DNI  BLADE-FUSE  [FUSE_3544-2]
F3  15A  BLADE-FUSE  [FUSE_3544-2]
IC2  MP2315GJ-Z  MP2315TSOT23-8  [SOT65P280X110-8N]
IC40  MP2315GJ-Z  MP2315TSOT23-8  [SOT65P280X110-8N]
J8  691244510006  [691244510006]
L3  4.7uH 3.5A  4.2UH  [SRR5228A]
L11  4.7uH 3.5A  4.2UH  [SRR5228A]
R22  33K 1%  33K-1%0201  [0201]
R23  40.2K 1%  40.2K-1%0201  [0201]
R33  12.7K 1%  12.7K-1%0201  [0201]
R34  10R 1%  10R-1%0201  [0201]
R36  75K 1%  75K-1%-0201  [0201]
R37  100K 1%  100K-1%0201  [0201]
R38  10K 1%  10K-1%0201  [0201]
R39  40.2K 1%  40.2K-1%0201  [0201]
R40  7.5K 1%  7.5K-1%0201  [0201]
R41  10R 1%  10R-1%0201  [0201]
R43  75K 1%  75K-1%-0201  [0201]
R44  100K 1%  100K-1%0201  [0201]
R45  10K 1%  10K-1%0201  [0201]
R70  100K 1%  100K-1%0201  [0201]
R71  10K 1%  10K-1%0201  [0201]
R72  100K 1%  100K-1%0201  [0201]
R73  10K 1%  10K-1%0201  [0201]
R74  100K 1%  100K-1%0201  [0201]
R75  10K 1%  10K-1%0201  [0201]

### Nets
3V3_EN_SYS1: IC40.6(EN) R37.2
3V3_EN_SYS2: IC2.6(EN) R44.2
24VINA: F3.1_1 F3.1_2 J8.3
24VINC: F1.1_1 F1.1_2 J8.1
+3V3: +3V.TP C31.1 C33.1 C36.1 L11.2 R23.1 ; also sheet 1,2,3,4,6,7
+5VA: +5VA.TP C72.1 C73.1 C75.1 L3.2 R39.1 ; also sheet 6
+24V_A: C256.1(+) C257.1(+) D11.C F3.2_1 F3.2_2 R70.1 ; supply symbol labelled +24VA ; also sheet 7
+24V_B: F2.2_1 F2.2_2 R72.1 ; supply symbol labelled +24VB
+24V_C: +24V.TP C34.1 C35.1 C71.1 C74.1 C252.1(+) C253.1(+) D9.C F1.2_1 F1.2_2 IC2.2(IN) IC40.2(IN) R37.1 R44.1 R74.1 ; supply symbol labelled +24VC
ADC_24VA: R70.2 R71.1 ; also sheet 2
ADC_24VB: R72.2 R73.1 ; also sheet 2
ADC_24VC: R74.2 R75.1 ; also sheet 2
GND: 24VGND.TP C31.2 C32.2 C33.2 C34.2 C35.2 C38.2 C71.2 C72.2 C73.2 C74.2 C84.2 C85.2 C252.2(-) C253.2(-) C256.2(-) C257.2(-) D9.A D11.A IC2.4(GND) IC40.4(GND) J8.4 J8.5 J8.6 R33.2 R36.2 R40.2 R43.2 R71.2 R73.2 R75.2 ; also sheet 1,2,3,4,6,7
N$2: IC2.5(BST) R41.1
N$3: IC2.8(FB) R38.1
N$10: C37.1 R41.2
N$11: 5VFB.TP C75.2 R39.2 R40.1 R45.2
N$12: C38.1 IC2.7(VCC)
N$13: C85.1 IC2.1(AAM) R43.1
N$14: R38.2 R45.1
N$18: F2.1_1 F2.1_2 J8.2
N$267: IC40.5(BST) R34.1
N$268: IC40.8(FB) R22.1
N$270: C30.1 R34.2
N$271: 3VFB.TP C36.2 R22.2 R23.2 R33.1
N$275: C32.1 IC40.7(VCC)
N$276: C84.1 IC40.1(AAM) R36.1
SW1: C37.2 IC2.3(SW) L3.1
SW3: C30.2 IC40.3(SW) L11.1

### Notes on the sheet
- EXT 24VDC INPUT | 3.3V DC-DC CONVERTER
- Vin = 4.5-24V
- FUSE BLOCK | LOAD COVERED | MAX CURRENT @24V | FUSE
- F1 | 4x USB-C (TPS552882) | ~11.1 A | 15 A slow-blow blade
- F3
- 4x USB-A (MP2315S) 
  + 3.3V System
- ~1.5 A | 2 A slow-blow blade
- VOUT (V) | RFB1 (kΩ) | RFB2 (kΩ) | RT (kΩ)
- 5V DC-DC CONVERTER
- 1.05 | 20.5 | 62.0 | 100.0
- 1.2 | 20.5 | 39.2 | 75.0
- 1.8 | 40.2 | 31.6 | 59.0
- Vin = 4.5-24V
- 2.5 | 40.2 | 18.7 | 40.2
- 3.3 | 40.2 | 12.7 | 33.0
- 5.0 | 40.2 | 7.5 | 20.0
- ETHERNET CONTROLLER

## Sheet 6 of 7
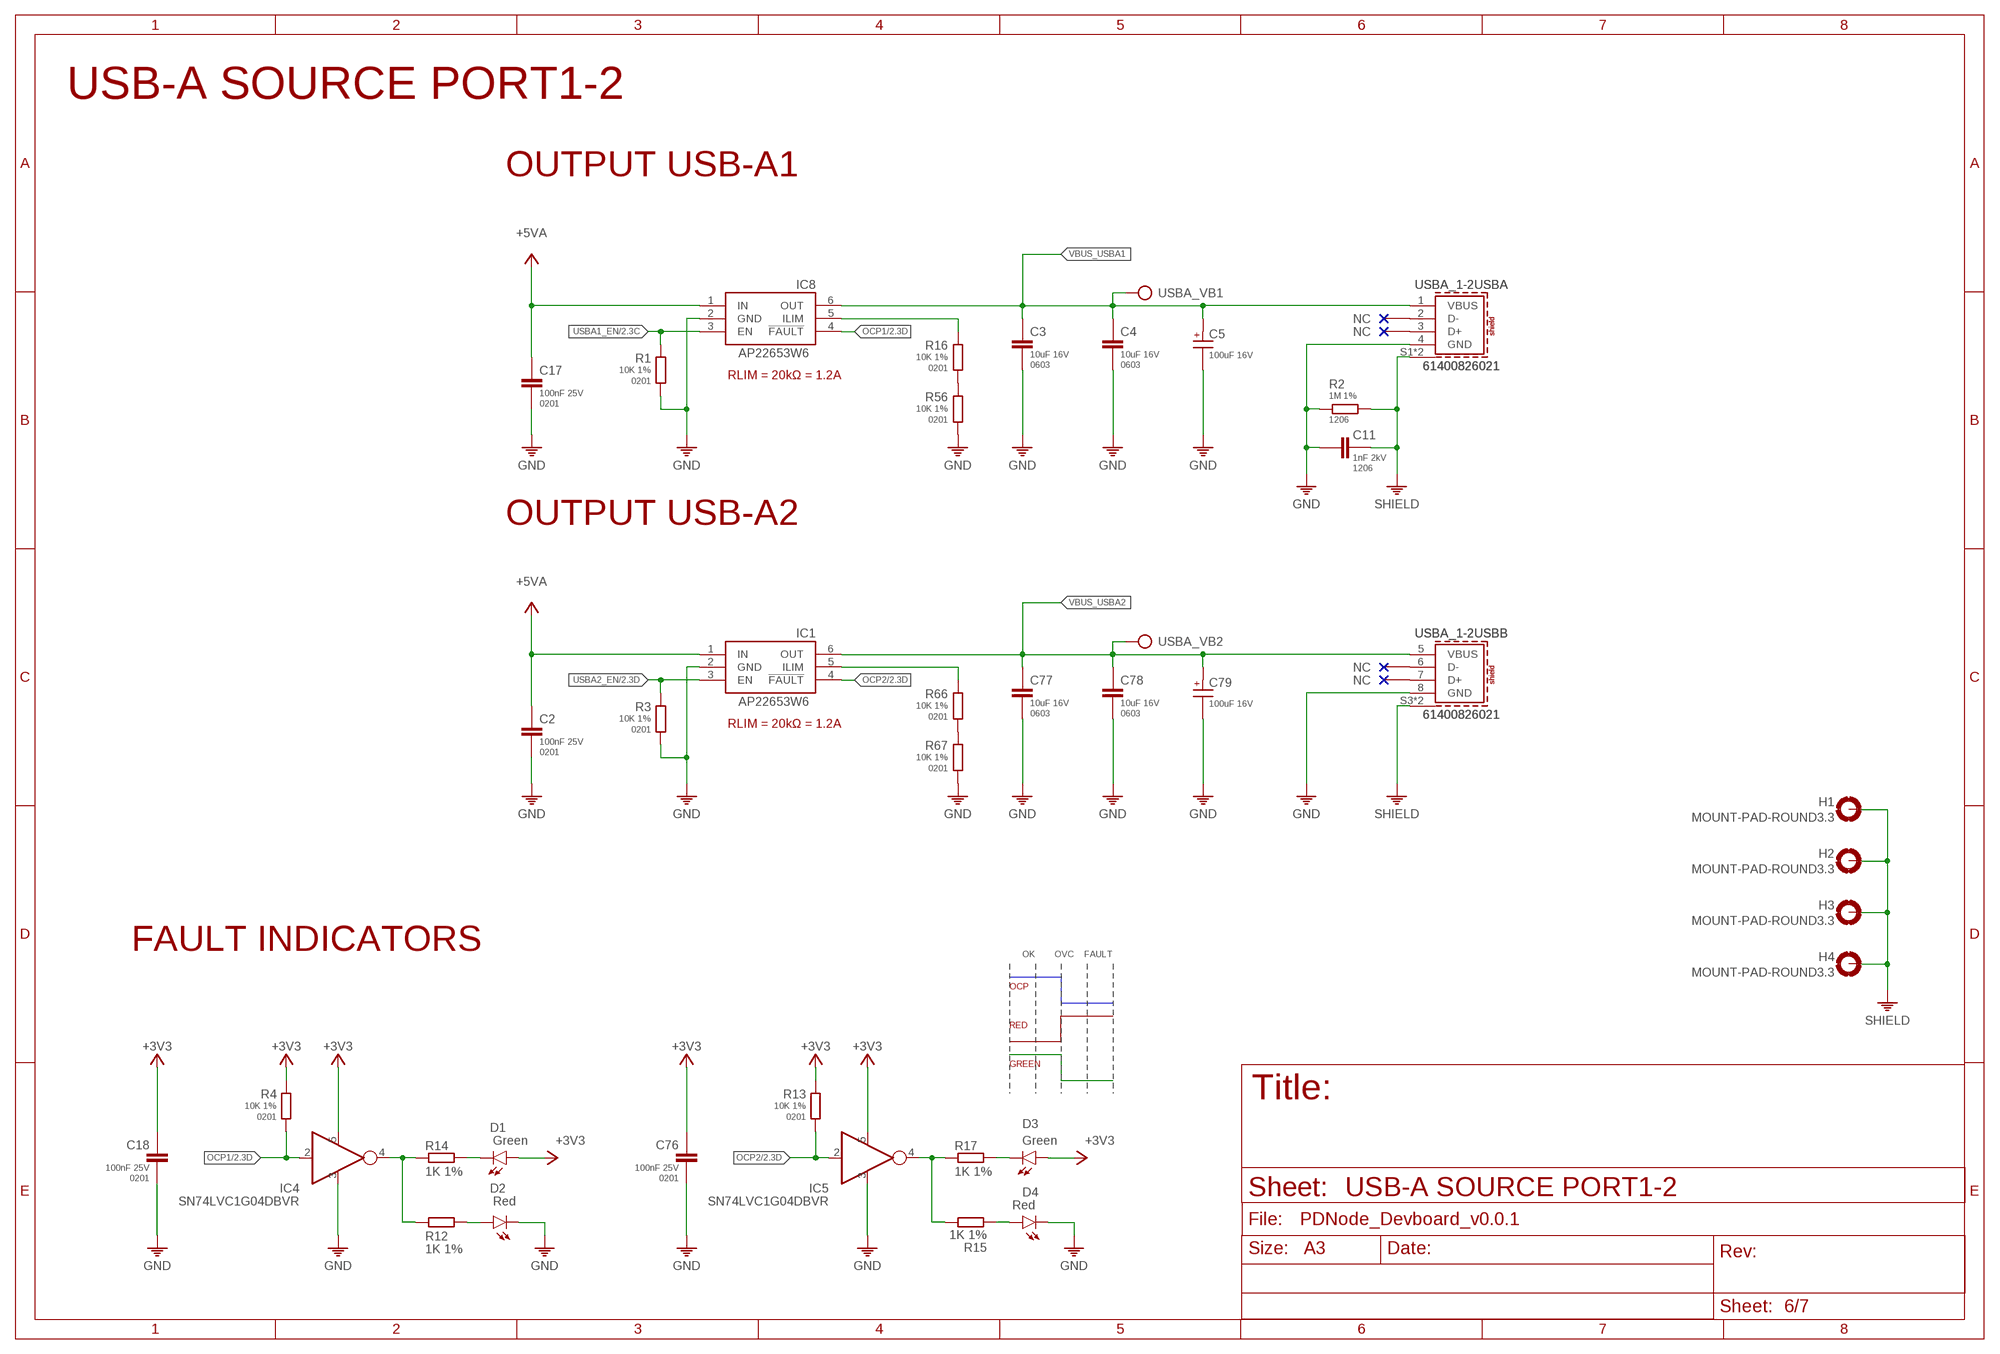
[diagram p5: schematic, sheet 6]

### Parts
C2  100nF 25V  100NF-25V-0201  [0201]
C3  10uF 16V  10UF-16V-0603  [0603]
C4  10uF 16V  10UF-16V-0603  [0603]
C5  100uF 16V  100UF-16V5X5.5(DXL)  [5X5.5(DXL)]
C11  1nF 2kV  1NF-2KV  [1206]
C17  100nF 25V  100NF-25V-0201  [0201]
C18  100nF 25V  100NF-25V-0201  [0201]
C76  100nF 25V  100NF-25V-0201  [0201]
C77  10uF 16V  10UF-16V-0603  [0603]
C78  10uF 16V  10UF-16V-0603  [0603]
C79  100uF 16V  100UF-16V5X5.5(DXL)  [5X5.5(DXL)]
D1  Green  LED-GREENLED-0603  [LED-0603]
D2  Red  LED-REDLED-0603  [LED-0603]
D3  Green  LED-GREENLED-0603  [LED-0603]
D4  Red  LED-REDLED-0603  [LED-0603]
H1  MOUNT-PAD-ROUND3.3  [3,3-PAD]
H2  MOUNT-PAD-ROUND3.3  [3,3-PAD]
H3  MOUNT-PAD-ROUND3.3  [3,3-PAD]
H4  MOUNT-PAD-ROUND3.3  [3,3-PAD]
IC1  AP22653W6  [SOT23-6]
IC4  SN74LVC1G04DBVR  74LVC1G04  [SOT95P280X145-5N]
IC5  SN74LVC1G04DBVR  74LVC1G04  [SOT95P280X145-5N]
IC8  AP22653W6  [SOT23-6]
R1  10K 1%  10K-1%0201  [0201]
R2  1M 1%  1M-1%1206  [1206]
R3  10K 1%  10K-1%0201  [0201]
R4  10K 1%  10K-1%0201  [0201]
R12  1K 1%  1K-1%0402  [0402]
R13  10K 1%  10K-1%0201  [0201]
R14  1K 1%  1K-1%0402  [0402]
R15  1K 1%  1K-1%0402  [0402]
R16  10K 1%  10K-1%0201  [0201]
R17  1K 1%  1K-1%0402  [0402]
R56  10K 1%  10K-1%0201  [0201]
R66  10K 1%  10K-1%0201  [0201]
R67  10K 1%  10K-1%0201  [0201]
USBA_1-2  61400826021  [61400826021]
USBA_VB1  DNI  TP-ROUND  [TP-ROUND]
USBA_VB2  DNI  TP-ROUND  [TP-ROUND]

### Nets
+3V3: C18.1 C76.1 D1.A D3.A IC4.5(V+) IC5.5(V+) R4.1 R13.1 ; also sheet 1,2,3,4,5,7
+5VA: C2.1 C17.1 IC1.1(IN) IC8.1(IN) ; also sheet 5
GND: C2.2 C3.2 C4.2 C5.2(-) C11.2 C17.2 C18.2 C76.2 C77.2 C78.2 C79.2(-) D2.C D4.C IC1.2(GND) IC4.3(V-) IC5.3(V-) IC8.2(GND) R1.2 R2.1 R3.2 R56.2 R67.2 USBA_1-2.4(USBA:GND) USBA_1-2.8(USBB:GND) ; also sheet 1,2,3,4,5,7
N$1: IC1.5(ILIM) R66.1
N$4: D2.A R12.2
N$5: IC4.4(OUT) R12.1 R14.1
N$6: D1.C R14.2
N$7: D4.A R15.1
N$8: IC5.4(OUT) R15.2 R17.1
N$9: D3.C R17.2
N$15: R16.2 R56.1
N$16: R66.2 R67.1
N$46: IC8.5(ILIM) R16.1
OCP1: IC4.2(IN) IC8.4(!FAULT) R4.2 ; also sheet 2
OCP2: IC1.4(!FAULT) IC5.2(IN) R13.2 ; also sheet 2
SHIELD: C11.1 H1.B3,3(MOUNT) H2.B3,3(MOUNT) H3.B3,3(MOUNT) H4.B3,3(MOUNT) R2.2 USBA_1-2.S1(USBA:SHIELD) USBA_1-2.S2(USBA:SHIELD) USBA_1-2.S3(USBB:SHIELD) USBA_1-2.S4(USBB:SHIELD) ; also sheet 3,4,7
USBA1_EN: IC8.3(EN) R1.1 ; also sheet 2
USBA2_EN: IC1.3(EN) R3.1 ; also sheet 2
VBUS_USBA1: C3.1 C4.1 C5.1(+) IC8.6(OUT) USBA_1-2.1(USBA:VBUS) USBA_VB1.TP
VBUS_USBA2: C77.1 C78.1 C79.1(+) IC1.6(OUT) USBA_1-2.5(USBB:VBUS) USBA_VB2.TP
Unconnected: USBA_1-2.2(USBA:D-) USBA_1-2.3(USBA:D+) USBA_1-2.6(USBB:D-) USBA_1-2.7(USBB:D+)

### Notes on the sheet
- USB-A SOURCE PORT1-2
- OUTPUT USB-A1
- RLIM = 20kΩ = 1.2A
- OUTPUT USB-A2
- RLIM = 20kΩ = 1.2A
- FAULT INDICATORS | OK | OVC | FAULT
- OCP
- RED
- GREEN
- USB-A SOURCE PORT1-2

## Sheet 7 of 7
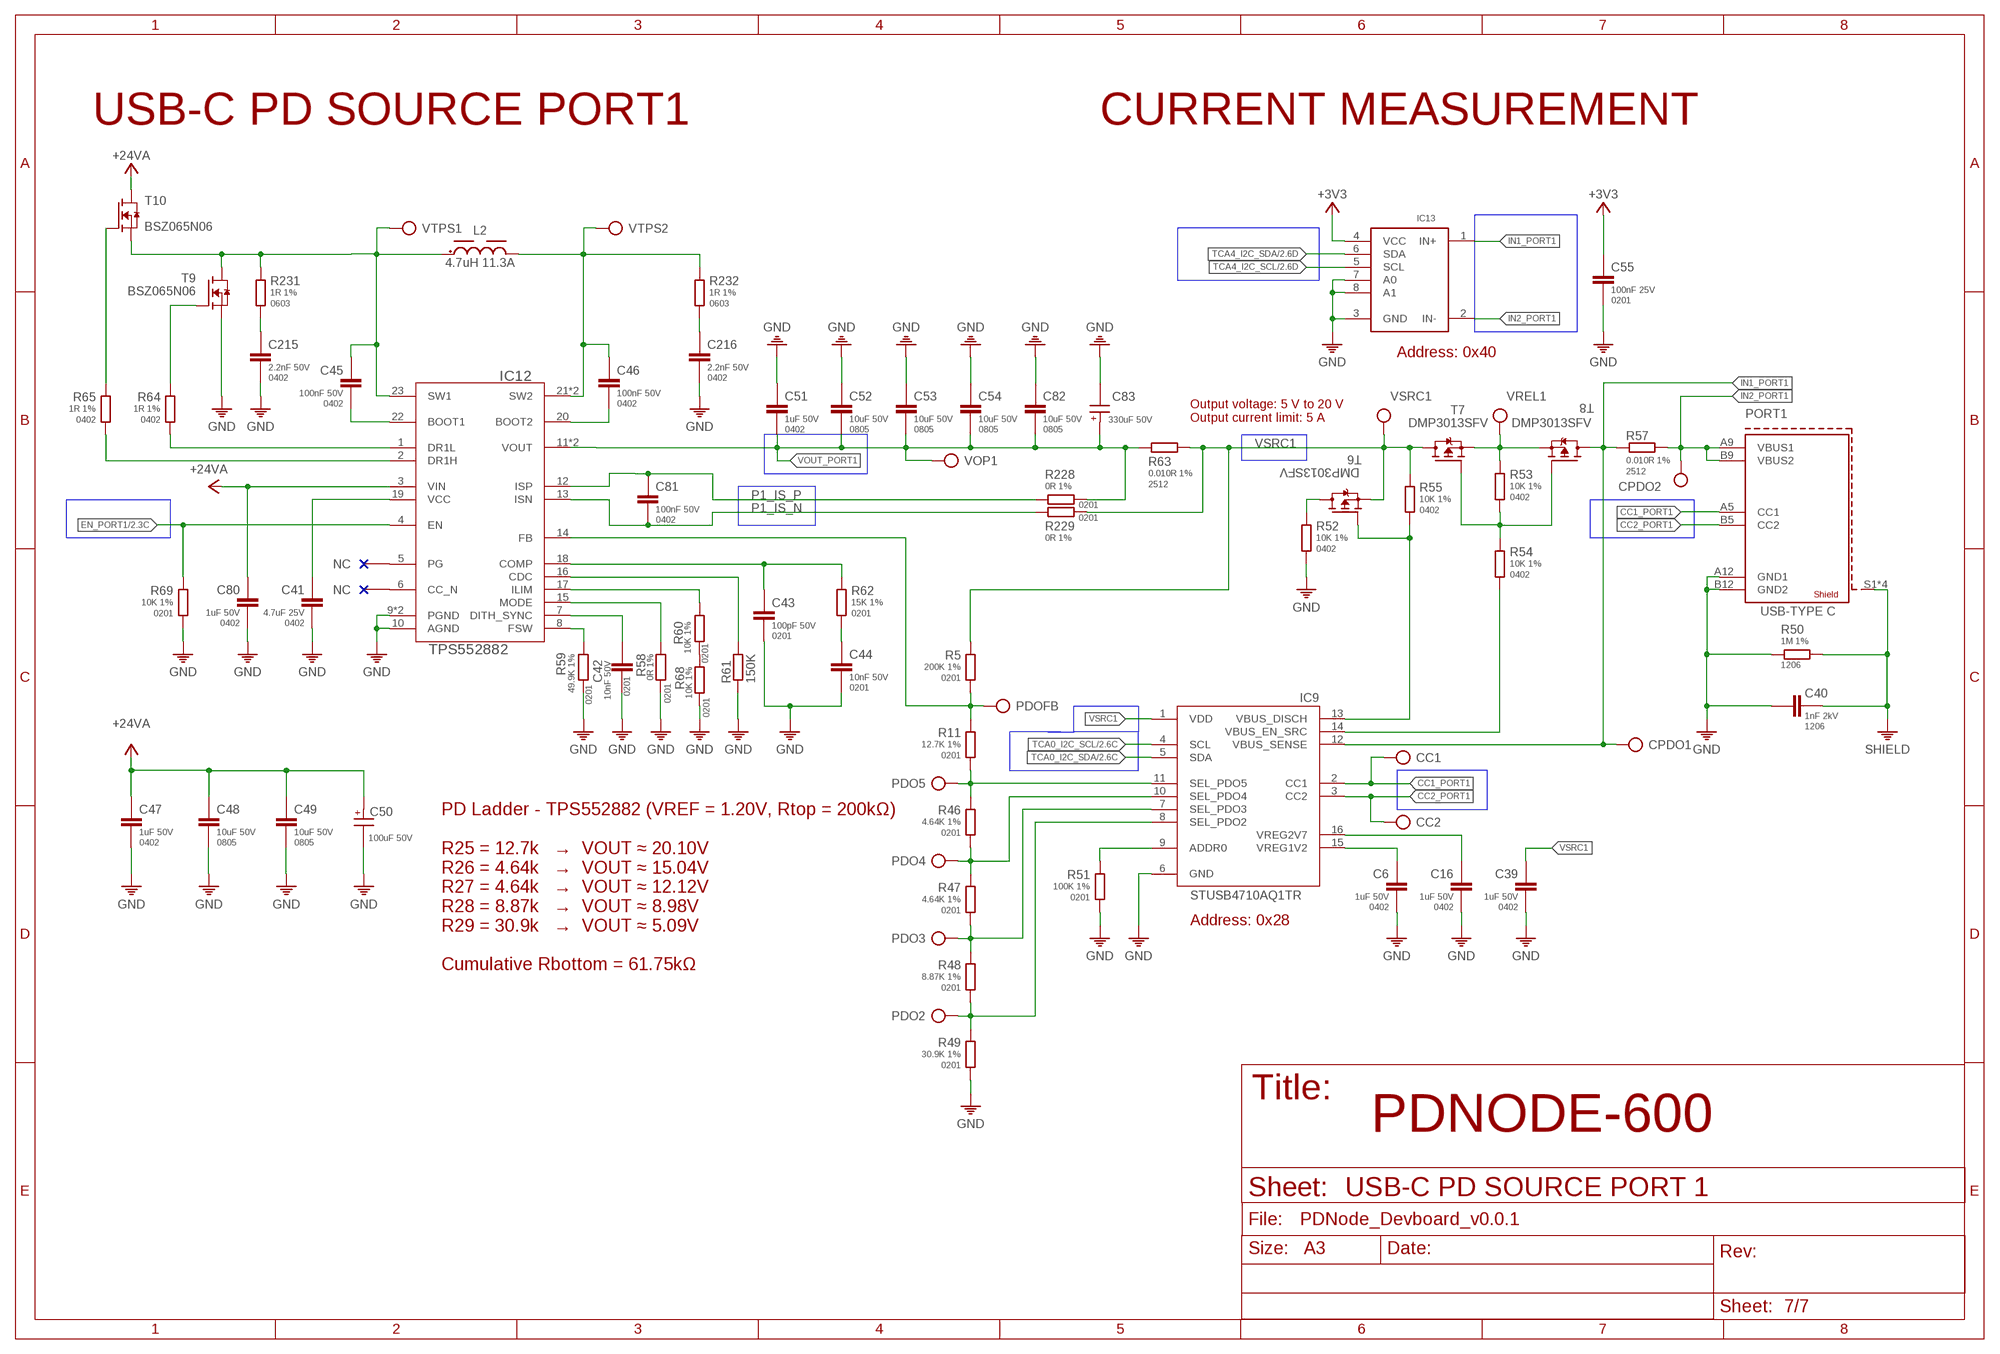
[diagram p6: schematic, sheet 7]

### Parts
C6  1uF 50V  1UF-50V0402  [0402]
C16  1uF 50V  1UF-50V0402  [0402]
C39  1uF 50V  1UF-50V0402  [0402]
C40  1nF 2kV  1NF-2KV  [1206]
C41  4.7uF 25V  4.7UF-25V0402  [0402]
C42  10nF 50V  10NF-50V-0201  [0201]
C43  100pF 50V  100PF-50V0201  [0201]
C44  10nF 50V  10NF-50V-0201  [0201]
C45  100nF 50V  100NF-50V-0402  [0402]
C46  100nF 50V  100NF-50V-0402  [0402]
C47  1uF 50V  1UF-50V0402  [0402]
C48  10uF 50V  10UF-50V-0805  [0805]
C49  10uF 50V  10UF-50V-0805  [0805]
C50  100uF 50V  100UF-50V6.3X7.7(DXL)  [6.3X7.7(DXL)]
C51  1uF 50V  1UF-50V0402  [0402]
C52  10uF 50V  10UF-50V-0805  [0805]
C53  10uF 50V  10UF-50V-0805  [0805]
C54  10uF 50V  10UF-50V-0805  [0805]
C55  100nF 25V  100NF-25V-0201  [0201]
C80  1uF 50V  1UF-50V0402  [0402]
C81  100nF 50V  100NF-50V-0402  [0402]
C82  10uF 50V  10UF-50V-0805  [0805]
C83  330uF 50V  330UF-50V10X10.5(DXL)  [10X10.5(DXL)]
C215  2.2nF 50V  2.2NF-50V-0402  [0402]
C216  2.2nF 50V  2.2NF-50V-0402  [0402]
CC1  DNI  TP-ROUND  [TP-ROUND]
CC2  DNI  TP-ROUND  [TP-ROUND]
CPDO1  DNI  TP-ROUND  [TP-ROUND]
CPDO2  DNI  TP-ROUND  [TP-ROUND]
IC9  STUSB4710AQ1TR  [QFN50P300X300X55-16N]
IC12  TPS552882  [RPM0026A-MFG]
IC13  INA219BIDCNT  [SOT23-8]
L2  4.7uH 11.3A  4.7UH-PWR  [WE-PDHV_1280]
PDO2  DNI  TP-ROUND  [TP-ROUND]
PDO3  DNI  TP-ROUND  [TP-ROUND]
PDO4  DNI  TP-ROUND  [TP-ROUND]
PDO5  DNI  TP-ROUND  [TP-ROUND]
PDOFB  DNI  TP-ROUND  [TP-ROUND]
PORT1  632722100213  USB-C-POWERONLY  [632722100213]
R5  200K 1%  200K-1%0201  [0201]
R11  12.7K 1%  12.7K-1%0201  [0201]
R46  4.64K 1%  4.64K-1%-0201  [0201]
R47  4.64K 1%  4.64K-1%-0201  [0201]
R48  8.87K 1%  8.87K-1%-0201  [0201]
R49  30.9K 1%  30.9K-1%0201  [0201]
R50  1M 1%  1M-1%1206  [1206]
R51  100K 1%  100K-1%0201  [0201]
R52  10K 1%  10K-1%0402  [0402]
R53  10K 1%  10K-1%0402  [0402]
R54  10K 1%  10K-1%0402  [0402]
R55  10K 1%  10K-1%0402  [0402]
R57  0.010R 1%  0.010R-1%-2512  [2512]
R58  0R 1%  0R0201  [0201]
R59  49.9K 1%  49.9K-1%0201  [0201]
R60  10K 1%  10K-1%0201  [0201]
R61  150K  R0201  [R0201]
R62  15K 1%  15K-1%0201  [0201]
R63  0.010R 1%  0.010R-1%-2512  [2512]
R64  1R 1%  1R-1%0402  [0402]
R65  1R 1%  1R-1%0402  [0402]
R68  10K 1%  10K-1%0201  [0201]
R69  10K 1%  10K-1%0201  [0201]
R228  0R 1%  0R0201  [0201]
R229  0R 1%  0R0201  [0201]
R231  1R 1%  1R-1%0603  [0603]
R232  1R 1%  1R-1%0603  [0603]
T6  DMP3013SFV  DMP3013SFV-7UX  [POWERDI3333-8_UX_DIO-L]
T7  DMP3013SFV  DMP3013SFV-7UX  [POWERDI3333-8_UX_DIO-L]
T8  DMP3013SFV  DMP3013SFV-7UX  [POWERDI3333-8_UX_DIO-L]
T9  BSZ065N06  IPZ40N04S5L7R4ATMA1  [POWERDI3333-8_UX_DIO-L]
T10  BSZ065N06  IPZ40N04S5L7R4ATMA1  [POWERDI3333-8_UX_DIO-L]
VOP1  DNI  TP-ROUND  [TP-ROUND]
VREL1  DNI  TP-ROUND  [TP-ROUND]
VSRC1  DNI  TP-ROUND  [TP-ROUND]
VTPS1  DNI  TP-ROUND  [TP-ROUND]
VTPS2  DNI  TP-ROUND  [TP-ROUND]

### Nets
+3V3: C55.1 IC13.4(VCC) ; also sheet 1,2,3,4,5,6
+24V_A: C47.1 C48.1 C49.1 C50.1(+) C80.1 IC12.3(VIN) T10.5(D) T10.6(D) T10.7(D) T10.8(D) T10.9(D) ; supply symbol labelled +24VA ; also sheet 5
CC1_PORT1: CC1.TP IC9.2(CC1) PORT1.A5(CC1)
CC2_PORT1: CC2.TP IC9.3(CC2) PORT1.B5(CC2)
DISCHARGE1: R52.1 T6.5(D) T6.6(D) T6.7(D) T6.8(D) T6.9(D)
EN_PORT1: IC12.4(EN) R69.1 ; also sheet 2
GND: C6.2 C16.2 C39.2 C40.1 C41.2 C42.2 C43.2 C44.2 C47.2 C48.2 C49.2 C50.2(-) C51.1 C52.1 C53.1 C54.1 C55.2 C80.2 C82.1 C83.2(-) C215.2 C216.2 IC9.6(GND) IC12.9(PGND) IC12.10(AGND) IC12.24(PGND) IC13.3(GND) IC13.7(A0) IC13.8(A1) PORT1.A12(GND1) PORT1.B12(GND2) R49.2 R50.1 R51.2 R52.2 R58.2 R59.2 R61.2 R68.2 R69.2 T9.1(S) T9.2(S) T9.3(S) ; also sheet 1,2,3,4,5,6
IN1_PORT1: CPDO1.TP IC9.12(VBUS_SENSE) IC13.1(IN+) R57.2 T8.5(D) T8.6(D) T8.7(D) T8.8(D) T8.9(D)
IN2_PORT1: CPDO2.TP IC13.2(IN-) PORT1.A9(VBUS1) PORT1.B9(VBUS2) R57.1
IND1: C45.1 IC12.23(SW1) L2.1 R231.1 T9.5(D) T9.6(D) T9.7(D) T9.8(D) T9.9(D) T10.1(S) T10.2(S) T10.3(S) VTPS1.TP
INDOUT1: C46.1 IC12.21(SW2) IC12.25(SW2) L2.2 R232.1 VTPS2.TP
N$17: R60.2 R68.1
N$31: IC12.14(FB) PDOFB.TP R5.2 R11.1
N$33: C215.1 R231.2
N$34: C216.1 R232.2
N$48: IC9.11(SEL_PDO5) PDO5.TP R11.2 R46.1
N$49: IC9.10(SEL_PDO4) PDO4.TP R46.2 R47.1
N$50: IC9.7(SEL_PDO3) PDO3.TP R47.2 R48.1
N$51: IC9.8(SEL_PDO2) PDO2.TP R48.2 R49.1
N$52: C6.1 IC9.15(VREG1V2)
N$53: C16.1 IC9.16(VREG2V7)
N$54: IC9.9(ADDR0) R51.1
N$56: IC9.13(VBUS_DISCH) R55.2 T6.4(G)
N$58: R53.2 R54.1 T7.4(G) T8.4(G)
N$59: IC9.14(VBUS_EN_SRC) R54.2
N$60: C44.1 R62.2
N$61: IC12.8(FSW) R59.1
N$62: C42.1 IC12.7(DITH_SYNC)
N$63: IC12.15(MODE) R58.1
N$64: IC12.17(ILIM) R60.1
N$65: IC12.16(CDC) R61.1
N$66: C43.1 IC12.18(COMP) R62.1
N$67: C41.1 IC12.19(VCC)
N$70: C45.2 IC12.22(BOOT1)
N$71: C46.2 IC12.20(BOOT2)
N$72: R65.1 T10.4(G)
N$73: R64.1 T9.4(G)
N$74: IC12.1(DR1L) R64.2
N$75: IC12.2(DR1H) R65.2
P1_IS_N [50R_DIFFPAIR]: C81.2 IC12.13(ISN) R229.1
P1_IS_P [50R_DIFFPAIR]: C81.1 IC12.12(ISP) R228.1
SHIELD: C40.2 PORT1.S1(SHIELD1) PORT1.S2(SHIELD1) PORT1.S3(SHIELD1) PORT1.S4(SHIELD1) R50.2 ; also sheet 3,4,6
SOURCE1: R53.1 T7.1(S) T7.2(S) T7.3(S) T8.1(S) T8.2(S) T8.3(S) VREL1.TP
TCA0_I2C_SCL: IC9.4(SCL) ; also sheet 2,3
TCA0_I2C_SDA: IC9.5(SDA) ; also sheet 2,3
TCA4_I2C_SCL: IC13.5(SCL) ; also sheet 2,3
TCA4_I2C_SDA: IC13.6(SDA) ; also sheet 2,3
VOUT_PORT1: C51.2 C52.2 C53.2 C54.2 C82.2 C83.1(+) IC12.11(VOUT) IC12.26(VOUT) R63.2 R228.2 VOP1.TP
VSRC1: C39.1 IC9.1(VDD) R5.1 R55.1 R63.1 R229.2 T6.1(S) T6.2(S) T6.3(S) T7.5(D) T7.6(D) T7.7(D) T7.8(D) T7.9(D) VSRC1.TP
Unconnected: IC12.5(PG) IC12.6(CC_N)

### Notes on the sheet
- USB-C PD SOURCE PORT1 | CURRENT MEASUREMENT
- Address: 0x40
- Output voltage: 5 V to 20 V
  Output current limit: 5 A
- Address: 0x28
- PD Ladder - TPS552882 (VREF = 1.20V, Rtop = 200kΩ)
  
  R25 = 12.7k   →  VOUT ≈ 20.10V
  R26 = 4.64k   →  VOUT ≈ 15.04V
  R27 = 4.64k   →  VOUT ≈ 12.12V
  R28 = 8.87k   →  VOUT ≈ 8.98V
  R29 = 30.9k   →  VOUT ≈ 5.09V
  
  Cumulative Rbottom = 61.75kΩ
- PDNODE-600
- USB-C PD SOURCE PORT 1